# Altium project PROC154E3_SCH.PrjPcb (part 1 of 60)
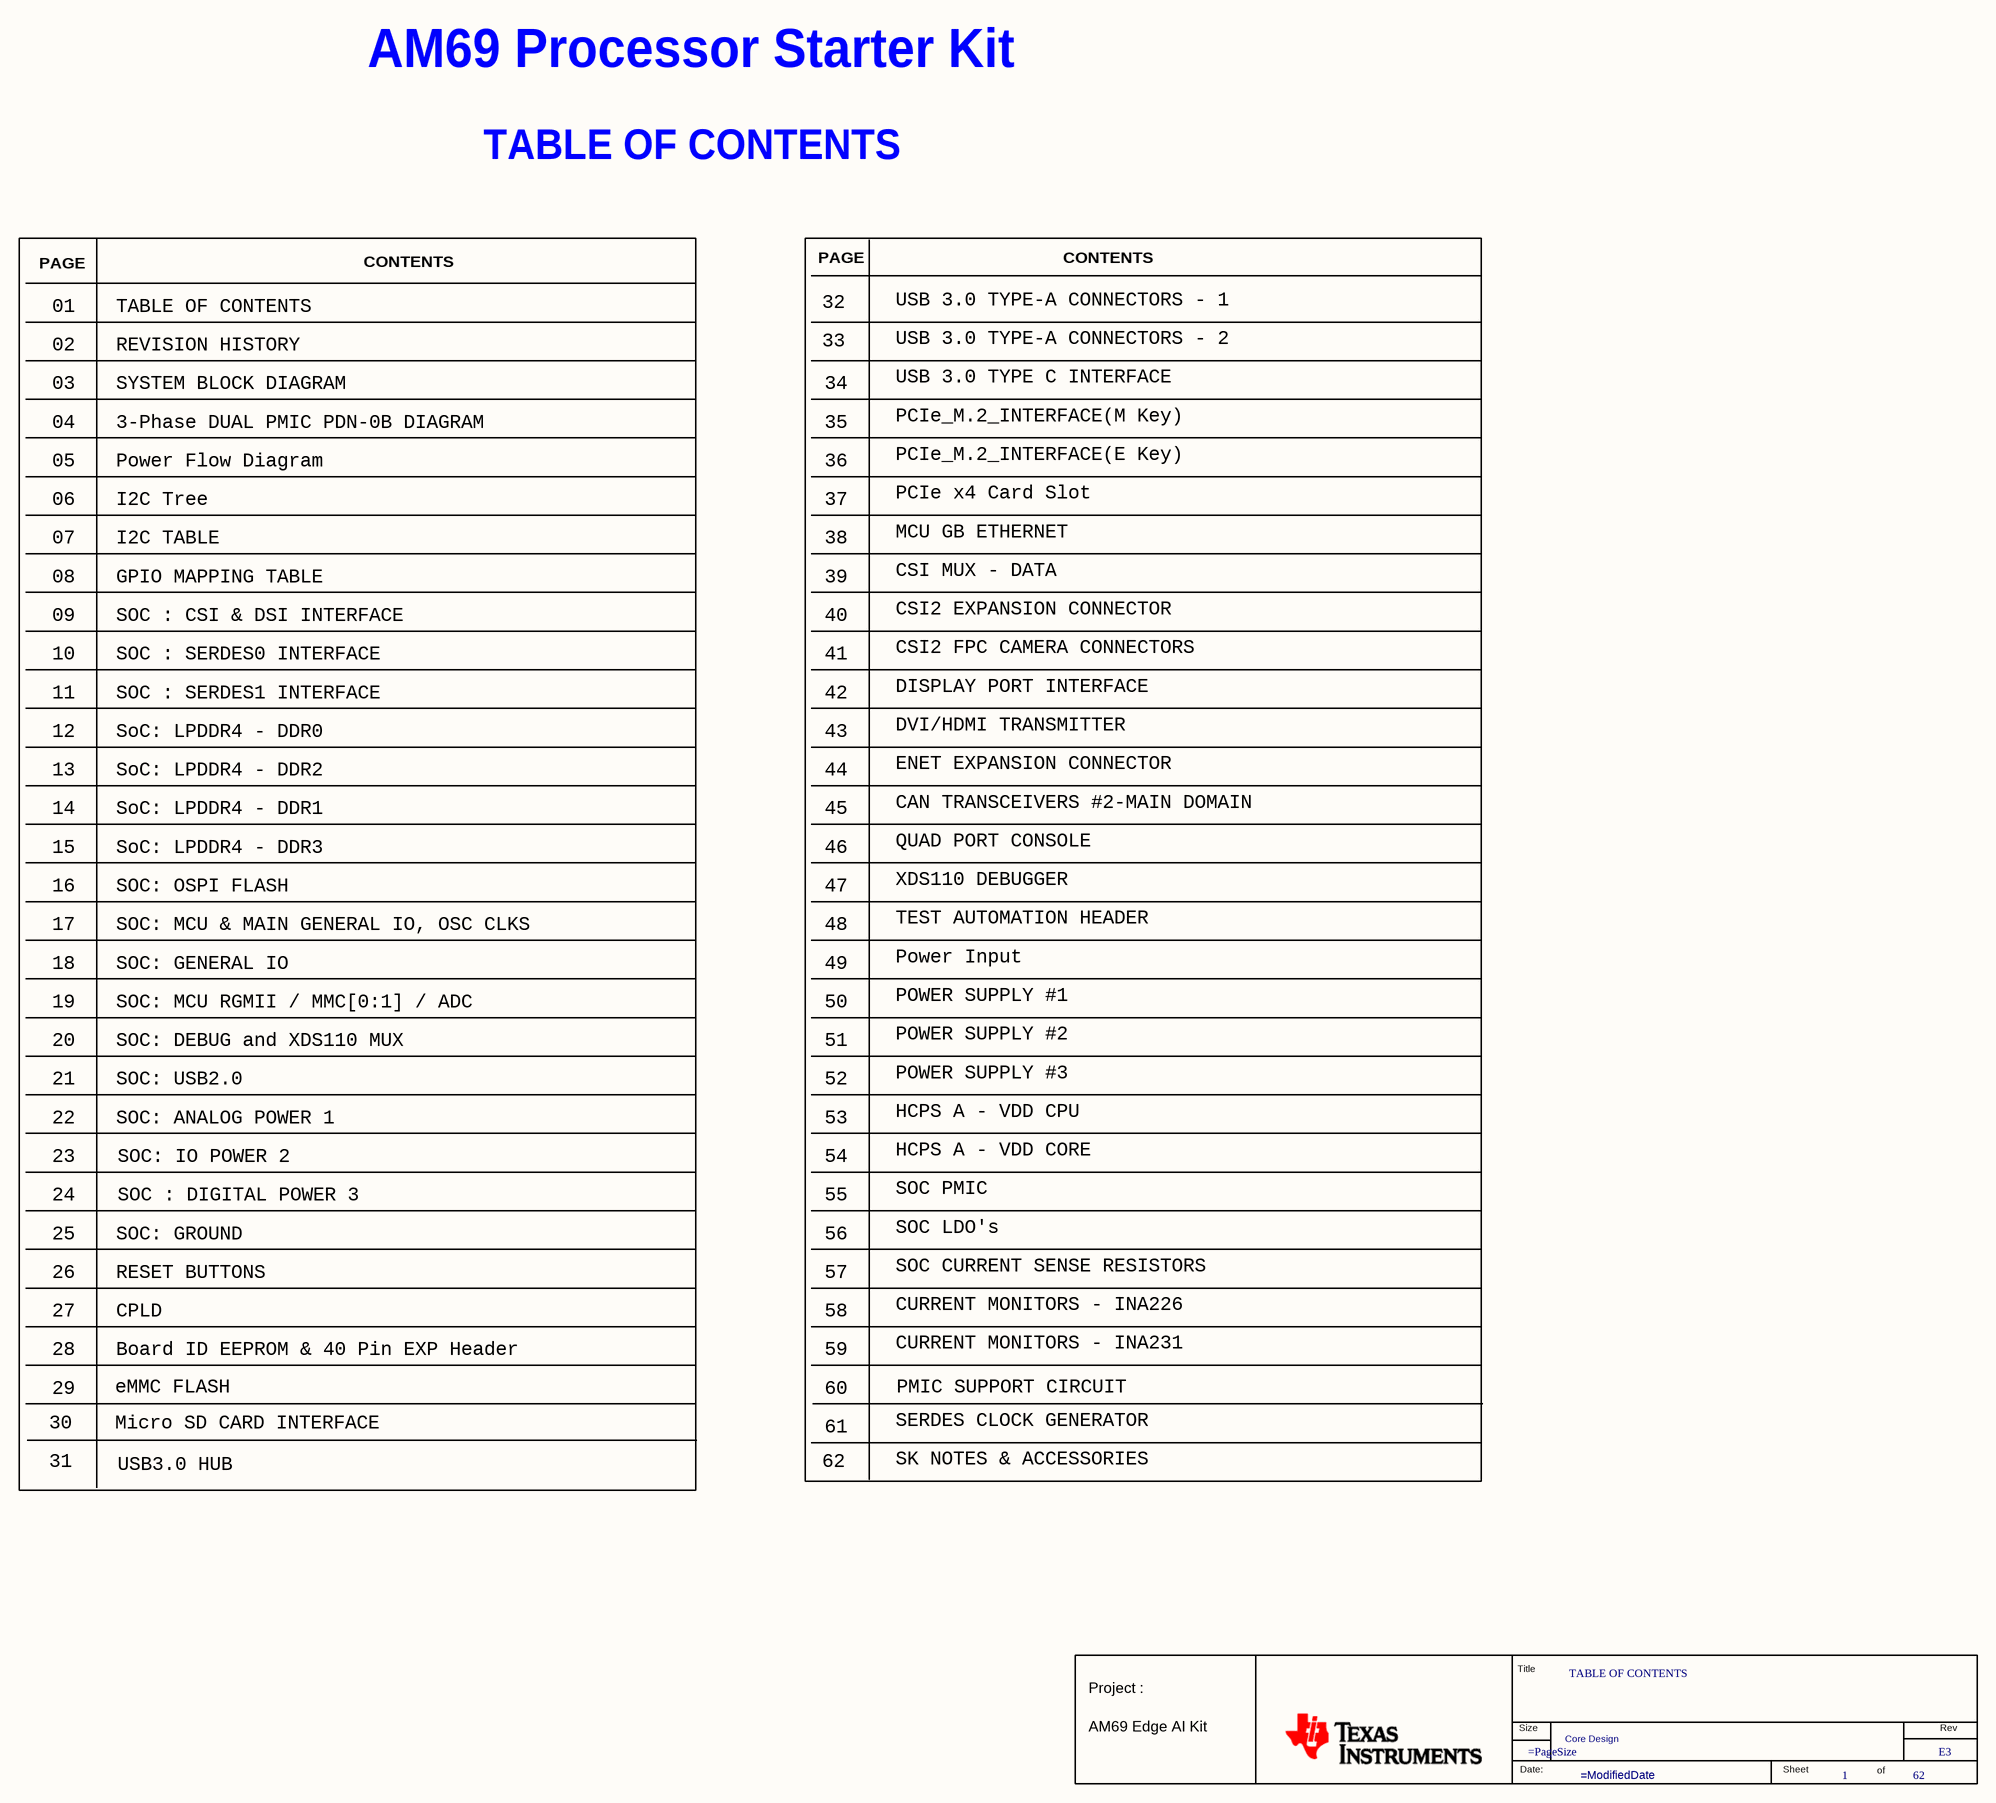
[diagram p0: 01. TABLE OF CONTENTS.SchDoc]
62 sheets, 2083 parts. Net scope: global (net labels, ports and power ports of the same name join across sheets).
Sheets:
  01. TABLE OF CONTENTS.SchDoc
  02. REVISION HISTORY.SchDoc
  03.  SYSTEM BLOCK DGM.SchDoc
  04.  SoC EVM PMIC PDN-0.6.SchDoc
  05.  POWER FLOW DIAGRAM.SchDoc
  06.  I2C TREE.SchDoc
  07.  I2C TABLE.SchDoc
  08. SOC GPIO_MAPPING_TABLE.SchDoc
  09. SOC CSI & DSI IF.SchDoc
  10. SOC SERDES0 IF.SchDoc
  11. SOC SERDES1 IF.SchDoc
  12. SOC EMIF0 & LPDDR4.SchDoc
  13. SOC EMIF1 & LPDDR4.SchDoc
  14. SOC EMIF2 & LPDDR4.SchDoc
  15. SOC EMIF3 & LPDDR4.SchDoc
  16. SOC MCU OSPI0 FLASH.SchDoc
  17. SOC MCU & MAIN GEN IO, OSC.SchDoc
  18. SOC GENERAL.SchDoc
  19. SOC MCU RGMII & MMC & ADCs.SchDoc
  20. SOC DEBUG.SchDoc
  21. SOC USB2.0.SchDoc
  22. SOC ANALOG POWER 1.SchDoc
  23. SOC IO & SUPPORT POWER 2.SchDoc
  24. SOC DIGITAL POWER 3.SchDoc
  25. SOC GND & KELVIN SENSING.SchDoc
  26. RESET BUTTONs.SchDoc
  27. CPLD.SchDoc
  28. BOARD ID & 40 Pin EXP Hdr.SchDoc
  29. eMMC.SchDoc
  30. MICRO SDCARD INTERFACE.SchDoc
  31. USB HUB.SchDoc
  32. USB 3.0 TYPE A CONN#1.SchDoc
  33. USB 3.0 TYPE A CONN#2.SchDoc
  34. USB TYPE C 3.0.SchDoc
  35. PCIe_M.2_INTERFACE SSD.SchDoc
  36. PCIe_M.2_INTERFACE SDIO.SchDoc
  37. PCIe_INTERFACE 4L.SchDoc
  38. MCU GB ETHERNET.SchDoc
  39. CSI MUX.SchDoc
  40. CSI2 CAMERA CONNECTOR.SchDoc
  41. FPC Camera.SchDoc
  42. DISPLAY PORT.SchDoc
  43. HDMI BRIDGE.SchDoc
  44. SGMII EXPANSION HDR.SchDoc
  45. CAN TRANSCEIVERS.SchDoc
  46. QUAD PORT CONSOLE.SchDoc
  47. XDS110 DEBUGGER.SchDoc
  48. TEST AUTOMATION HEADER.SchDoc
  49. POWER INPUT.SchDoc
  50. POWER SUPPLY #1.SchDoc
  51. POWER SUPPLY #2.SchDoc
  52. POWER SUPPLY #3.SchDoc
  53. SOC CPU HCPS-A.SchDoc
  54. SOC CORE HCPS-B.SchDoc
  55. SOC PMIC.SchDoc
  56. SOC LDOs & LD SWITCHES.SchDoc
  57. EVM SOC CURRENT_SENSE_RES.SchDoc
  58. CURRENT MONITORS.SchDoc
  59. CURRENT MONITORS -INA231.SchDoc
  60. SVS MONITOR.SchDoc
  61. SERDES CLOCK GENERATORS.SchDoc
  62. SK NOTES, HW & LABELS.SchDoc

## Sheet 01. TABLE OF CONTENTS.SchDoc: TABLE OF CONTENTS
size 513 x 386 mm; Page Create Date: March  8, 1995; Variant Name: Core Design; Page Number: 1; Schematic Page Number: 1; Page Size: C; Comment: MISTRAL_TITLEBLK_CSIZE_1; Page Count: 62; Project: PROC154E2(001)_SK_AM69; Issue: 1.0; RevCode: E3; DsnPath: C:\Users\danie\Downloads\sprr466c\PROC154E3_RP\PROC154E3_SCH.DSN; SchematicName: SCHEMATIC1; PageName: 01. TABLE OF CONTENTS; PageSize: C; TopSchematic: True

### Parts
(Parts that share a designator on the sheet are numbered #1, #2 ... from top to bottom, then left to right.)
*#1  RevCode: E3  Title: TABLE OF CONTENTS  Page Number: 1  Page Count: 62  Variant Name: Core Design  (hidden comment: MISTRAL_TITLEBLK_CSIZE_1)  (graphical)

### Notes on the sheet
- AM69 Processor Starter Kit
- TABLE OF CONTENTS
- PAGE
- CONTENTS
- 01
- 32
- USB 3.0 TYPE-A CONNECTORS - 1
- 02
- 03
- REVISION HISTORY
- SYSTEM BLOCK DIAGRAM
- 33
- 34
- USB 3.0 TYPE-A CONNECTORS - 2
- USB 3.0 TYPE C INTERFACE
- 04
- 05
- Power Flow Diagram
- 3-Phase DUAL PMIC PDN-0B DIAGRAM
- 35
- 36
- PCIe_M.2_INTERFACE(M Key)
- PCIe_M.2_INTERFACE(E Key)
- 06
- I2C Tree
- 37
- PCIe x4 Card Slot
- 07
- 08
- I2C TABLE
- GPIO MAPPING TABLE
- 38
- 39
- MCU GB ETHERNET
- CSI MUX - DATA
- 10
- 09
- SOC : CSI & DSI INTERFACE
- SOC : SERDES0 INTERFACE
- 40
- 41
- CSI2 EXPANSION CONNECTOR
- CSI2 FPC CAMERA CONNECTORS
- 11
- SOC : SERDES1 INTERFACE
- 42
- DISPLAY PORT INTERFACE
- 12
- 13
- SoC: LPDDR4 - DDR2
- SoC: LPDDR4 - DDR0
- 43
- 44
- DVI/HDMI TRANSMITTER
- ENET EXPANSION CONNECTOR
- 14
- 15
- SoC: LPDDR4 - DDR1
- SoC: LPDDR4 - DDR3
- 45
- 46
- CAN TRANSCEIVERS #2-MAIN DOMAIN
- QUAD PORT CONSOLE
- 16
- SOC: OSPI FLASH
- 47
- XDS110 DEBUGGER
- 17
- 18
- SOC: MCU & MAIN GENERAL IO, OSC CLKS
- SOC: GENERAL IO
- 48
- 49
- TEST AUTOMATION HEADER
- Power Input
- 19
- 20
- SOC: MCU RGMII / MMC[0:1] / ADC
- SOC: DEBUG and XDS110 MUX
- 50
- 51
- POWER SUPPLY #1
- POWER SUPPLY #2
- 21
- SOC: USB2.0
- 52
- POWER SUPPLY #3
- 22
- 23
- SOC: ANALOG POWER 1
- SOC: IO POWER 2
- 53
- 54
- HCPS A - VDD CPU
- HCPS A - VDD CORE
- 24
- 25
- SOC: GROUND
- SOC : DIGITAL POWER 3
- 55
- 56
- SOC PMIC
- SOC LDO's
- 26
- RESET BUTTONS
- 57
- SOC CURRENT SENSE RESISTORS
- 27
- 28
- CPLD
- Board ID EEPROM & 40 Pin EXP Header
- 58
- 59
- CURRENT MONITORS - INA226
- CURRENT MONITORS - INA231
- 30
- 29
- Micro SD CARD INTERFACE
- eMMC FLASH
- 60
- 61
- SERDES CLOCK GENERATOR
- PMIC SUPPORT CIRCUIT
- 31
- USB3.0 HUB
- 62
- SK NOTES & ACCESSORIES
- (in symbol MISTRAL_TITLEBLK_CSIZE_1) Title; Project :; Size; Rev; AM69 Edge AI Kit; Date:; Sheet; of

### Library data of the parts
*#1 = MISTRAL_TITLEBLK_CSIZE_1: Issue: 1.0; Project: PROC154E2(001)_SK_AM69; Page Create Date: March  8, 1995; Page Size: =PageSize; Page Modify Date: =ModifiedDate; Schematic Page Number: 1

## Sheet 02. REVISION HISTORY.SchDoc: REVISION HISTORY
size 513 x 386 mm; Project: PROC154E2(001)_SK_AM69; Issue: 1.0; RevCode: E3; Page Create Date: March  8, 1995; Variant Name: Core Design; Schematic Page Number: 2; Page Number: 2; Page Size: C; Comment: MISTRAL_TITLEBLK_CSIZE_1; Page Count: 62; Schematic Page Count: 62; Name: PROC154E2 001 SK AM69; DsnPath: C:\Users\danie\Downloads\sprr466c\PROC154E3_RP\PROC154E3_SCH.DSN; SchematicName: SCHEMATIC1; PageName: 02. REVISION HISTORY; PageSize: C; TopSchematic: True
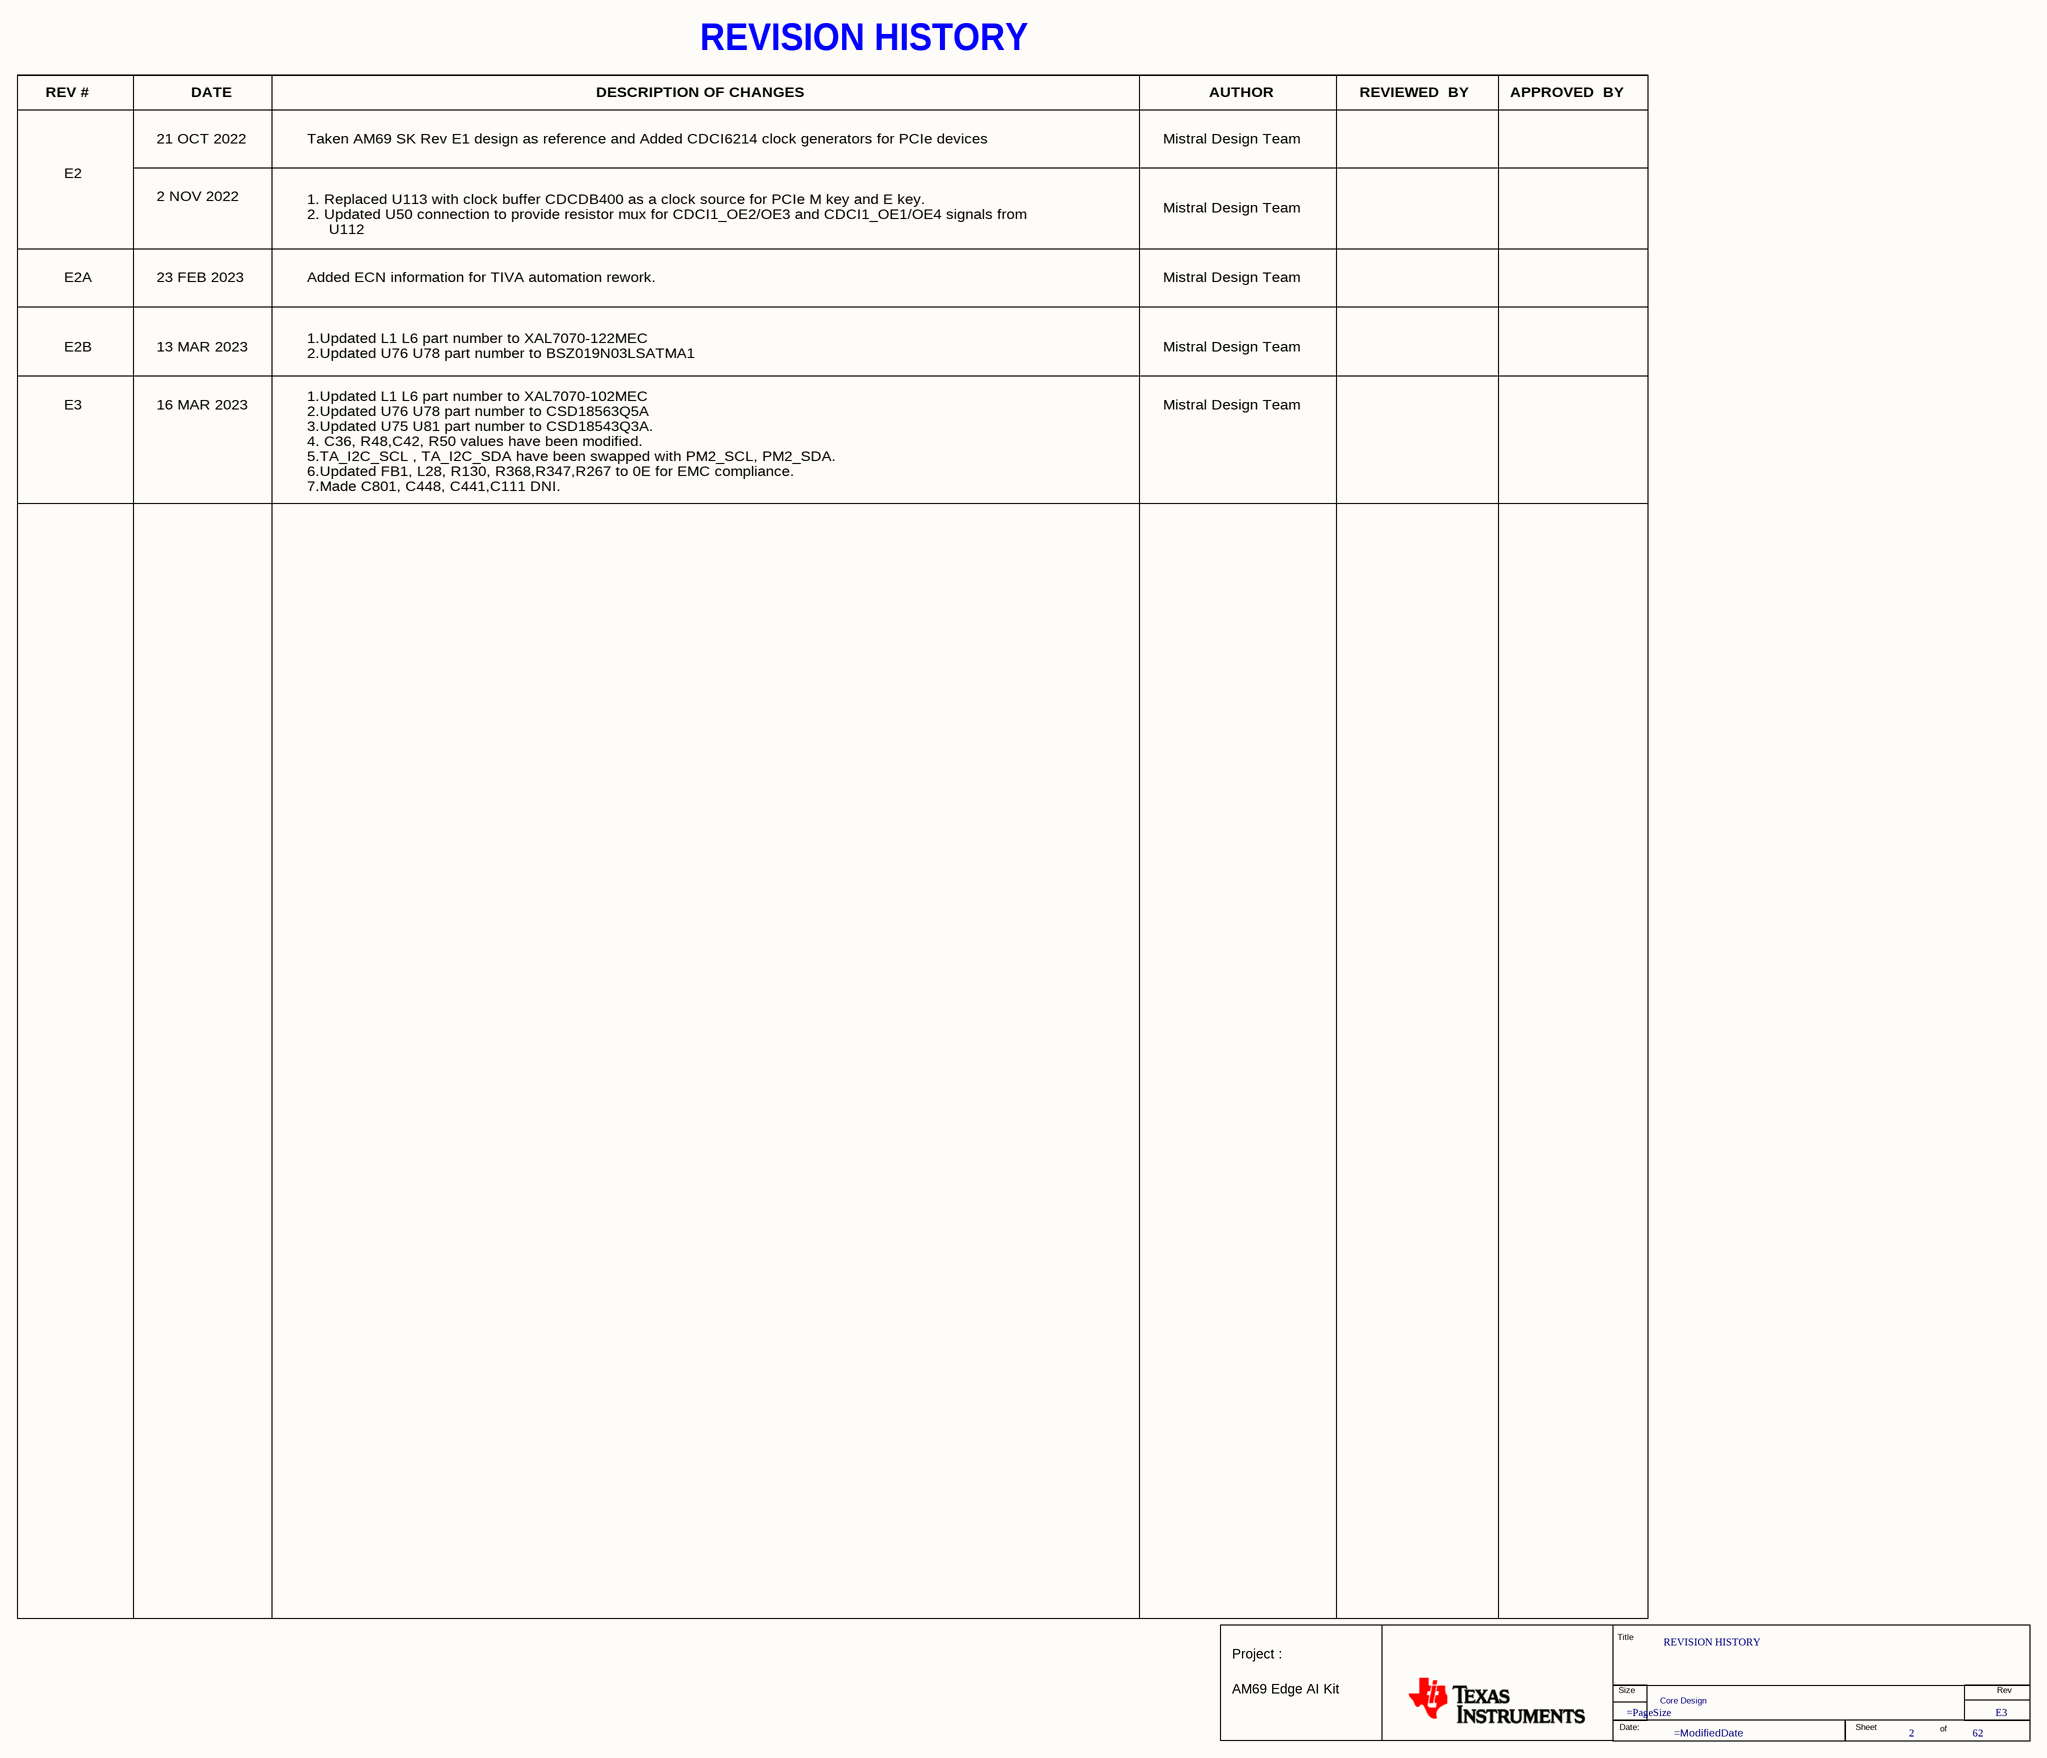
[diagram p1: 02. REVISION HISTORY.SchDoc]

### Parts
(Parts that share a designator on the sheet are numbered #1, #2 ... from top to bottom, then left to right.)
*#2  RevCode: E3  Title: REVISION HISTORY  Page Number: 2  Page Count: 62  Variant Name: Core Design  (hidden comment: MISTRAL_TITLEBLK_CSIZE_1)  (graphical)

### Notes on the sheet
- REV #
- DATE
- DESCRIPTION OF CHANGES
- REVISION HISTORY
- AUTHOR
- REVIEWED  BY
- APPROVED  BY
- 21 OCT 2022
- Taken AM69 SK Rev E1 design as reference and Added CDCI6214 clock generators for PCIe devices
- Mistral Design Team
- E2
- 2 NOV 2022
- 1. Replaced U113 with clock buffer CDCDB400 as a clock source for PCIe M key and E key.
  2. Updated U50 connection to provide resistor mux for CDCI1_OE2/OE3 and CDCI1_OE1/OE4 signals from
  U112
- E2A
- 23 FEB 2023
- Added ECN information for TIVA automation rework.
- 1.Updated L1 L6 part number to XAL7070-122MEC
  2.Updated U76 U78 part number to BSZ019N03LSATMA1
- E2B
- 13 MAR 2023
- 1.Updated L1 L6 part number to XAL7070-102MEC
  2.Updated U76 U78 part number to CSD18563Q5A
  3.Updated U75 U81 part number to CSD18543Q3A.
  4. C36, R48,C42, R50 values have been modified.
  5.TA_I2C_SCL , TA_I2C_SDA have been swapped with PM2_SCL, PM2_SDA.
  6.Updated FB1, L28, R130, R368,R347,R267 to 0E for EMC compliance.
  7.Made C801, C448, C441,C111 DNI.
- E3
- 16 MAR 2023
- (in symbol MISTRAL_TITLEBLK_CSIZE_1) Title; Project :; Size; Rev; AM69 Edge AI Kit; Date:; Sheet; of

### Library data of the parts
*#2 = MISTRAL_TITLEBLK_CSIZE_1: Issue: 1.0; Project: PROC154E2(001)_SK_AM69; Name: PROC154E2 001 SK AM69; Page Create Date: March  8, 1995; Page Size: =PageSize; Page Modify Date: =ModifiedDate; Schematic Page Count: 62; Schematic Page Number: 2

## Sheet 03.  SYSTEM BLOCK DGM.SchDoc: SYSTEM BLOCK DIAGRAM
size 513 x 386 mm; Project: PROC154E2(001)_SK_AM69; Issue: 1.0; RevCode: E3; Page Create Date: March  8, 1995; Variant Name: Core Design; Schematic Page Number: 3; Page Number: 3; Page Size: C; Comment: MISTRAL_TITLEBLK_CSIZE_1; Page Count: 62; Schematic Page Count: 62; Name: PROC154E2 001 SK AM69; DsnPath: C:\Users\danie\Downloads\sprr466c\PROC154E3_RP\PROC154E3_SCH.DSN; SchematicName: SCHEMATIC1; PageName: 03.  SYSTEM BLOCK DGM; PageSize: C; TopSchematic: True
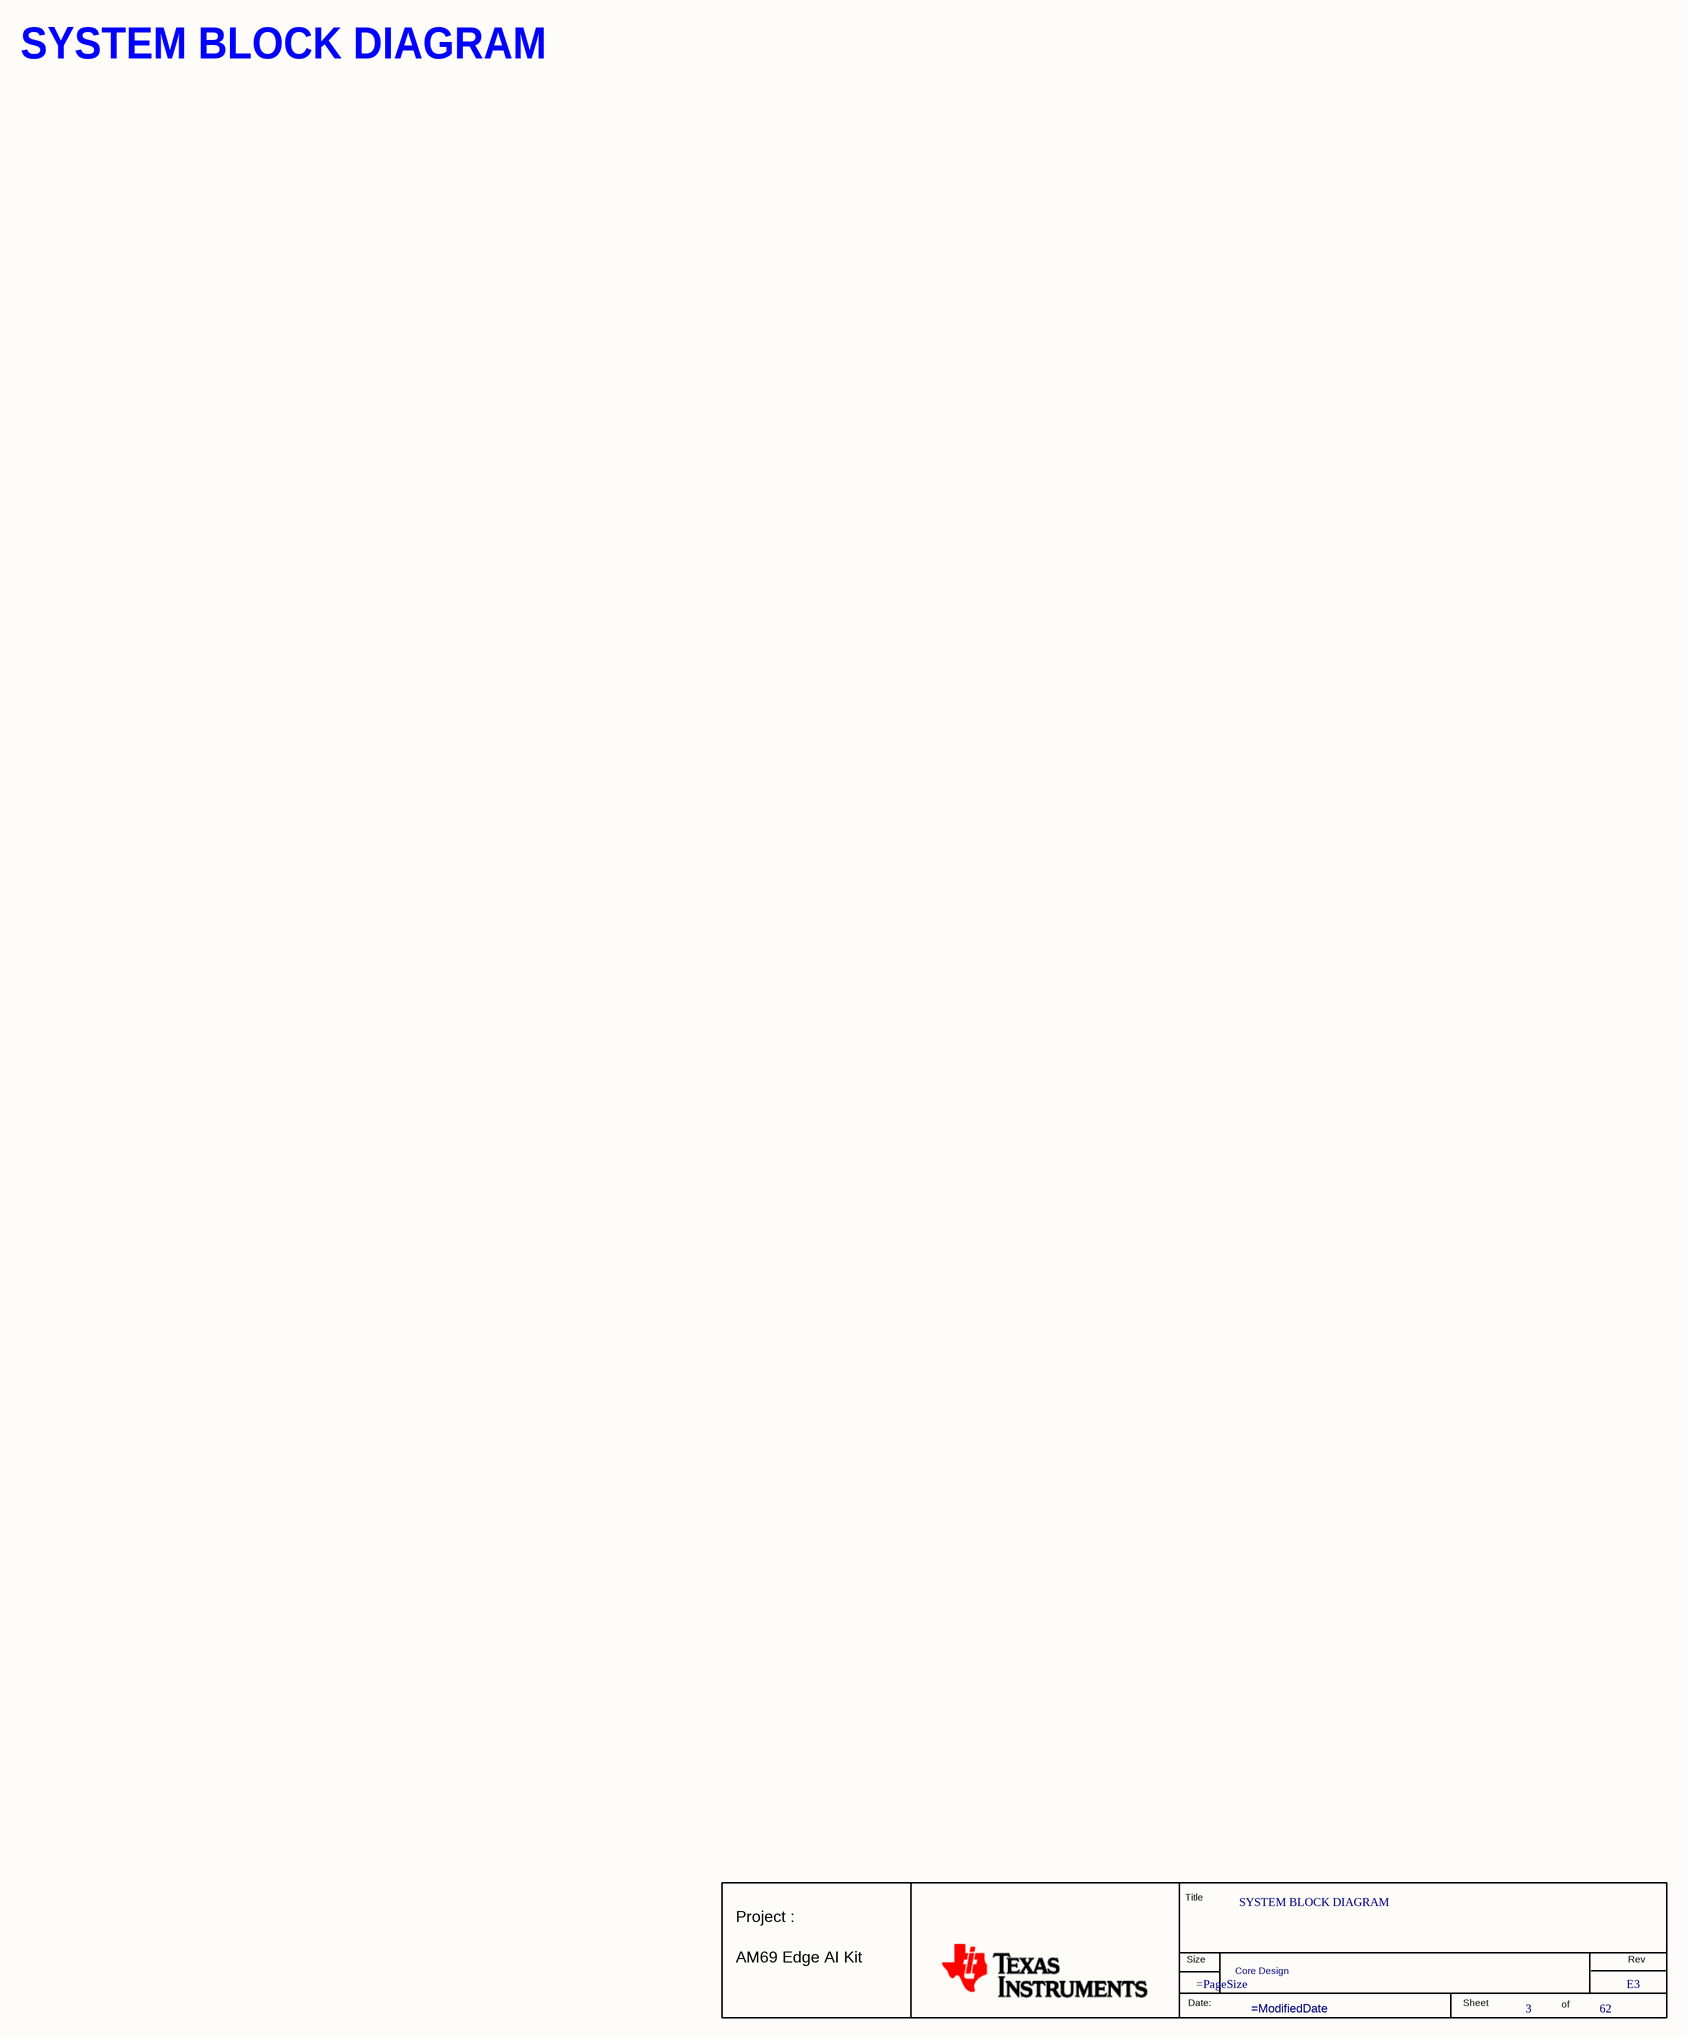
[diagram p2: 03.  SYSTEM BLOCK DGM.SchDoc]

### Parts
(Parts that share a designator on the sheet are numbered #1, #2 ... from top to bottom, then left to right.)
*#3  RevCode: E3  Title: SYSTEM BLOCK DIAGRAM  Page Number: 3  Page Count: 62  Variant Name: Core Design  (hidden comment: MISTRAL_TITLEBLK_CSIZE_1)  (graphical)

### Notes on the sheet
- SYSTEM BLOCK DIAGRAM
- (in symbol MISTRAL_TITLEBLK_CSIZE_1) Title; Project :; Size; Rev; AM69 Edge AI Kit; Date:; Sheet; of

### Library data of the parts
*#3 = MISTRAL_TITLEBLK_CSIZE_1: as *#2 on sheet 02. REVISION HISTORY; Page Create Date: March  8, 1995; Page Size: =PageSize; Page Modify Date: =ModifiedDate; Schematic Page Count: 62; Schematic Page Number: 3

## Sheet 04.  SoC EVM PMIC PDN-0.6.SchDoc: SoC EVM PMIC PDN-0.6
size 513 x 386 mm; Project: PROC154E2(001)_SK_AM69; Issue: 1.0; RevCode: E3; Page Create Date: March  8, 1995; Variant Name: Core Design; Schematic Page Number: 4; Page Number: 4; Page Size: C; Comment: MISTRAL_TITLEBLK_CSIZE_1; Page Count: 62; Schematic Page Count: 62; Name: PROC154E2 001 SK AM69; DsnPath: C:\Users\danie\Downloads\sprr466c\PROC154E3_RP\PROC154E3_SCH.DSN; SchematicName: SCHEMATIC1; PageName: 04.  SoC EVM PMIC PDN-0.6; PageSize: C; TopSchematic: True
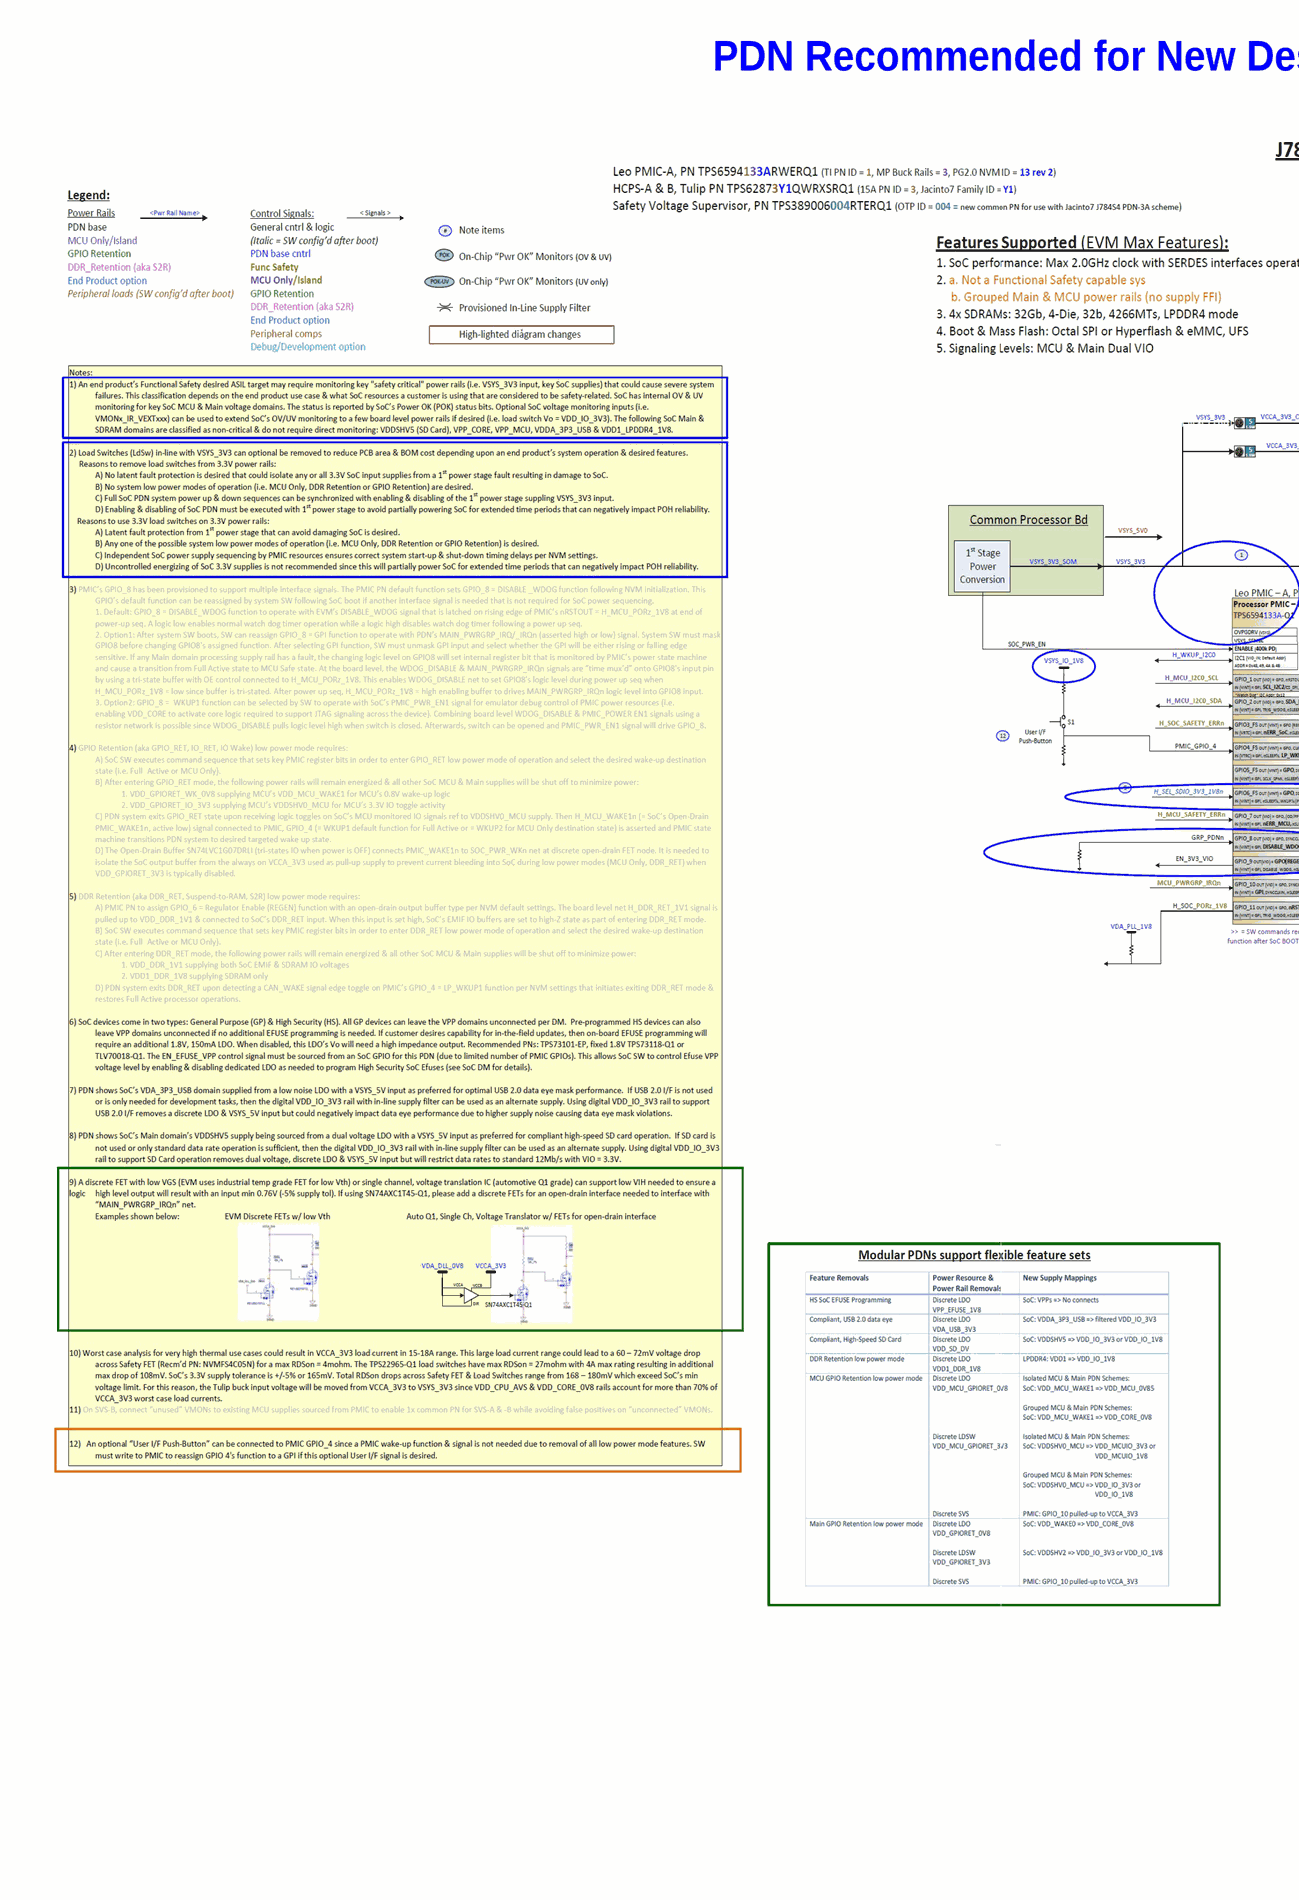
[diagram p3: 04.  SoC EVM PMIC PDN-0.6.SchDoc, left]
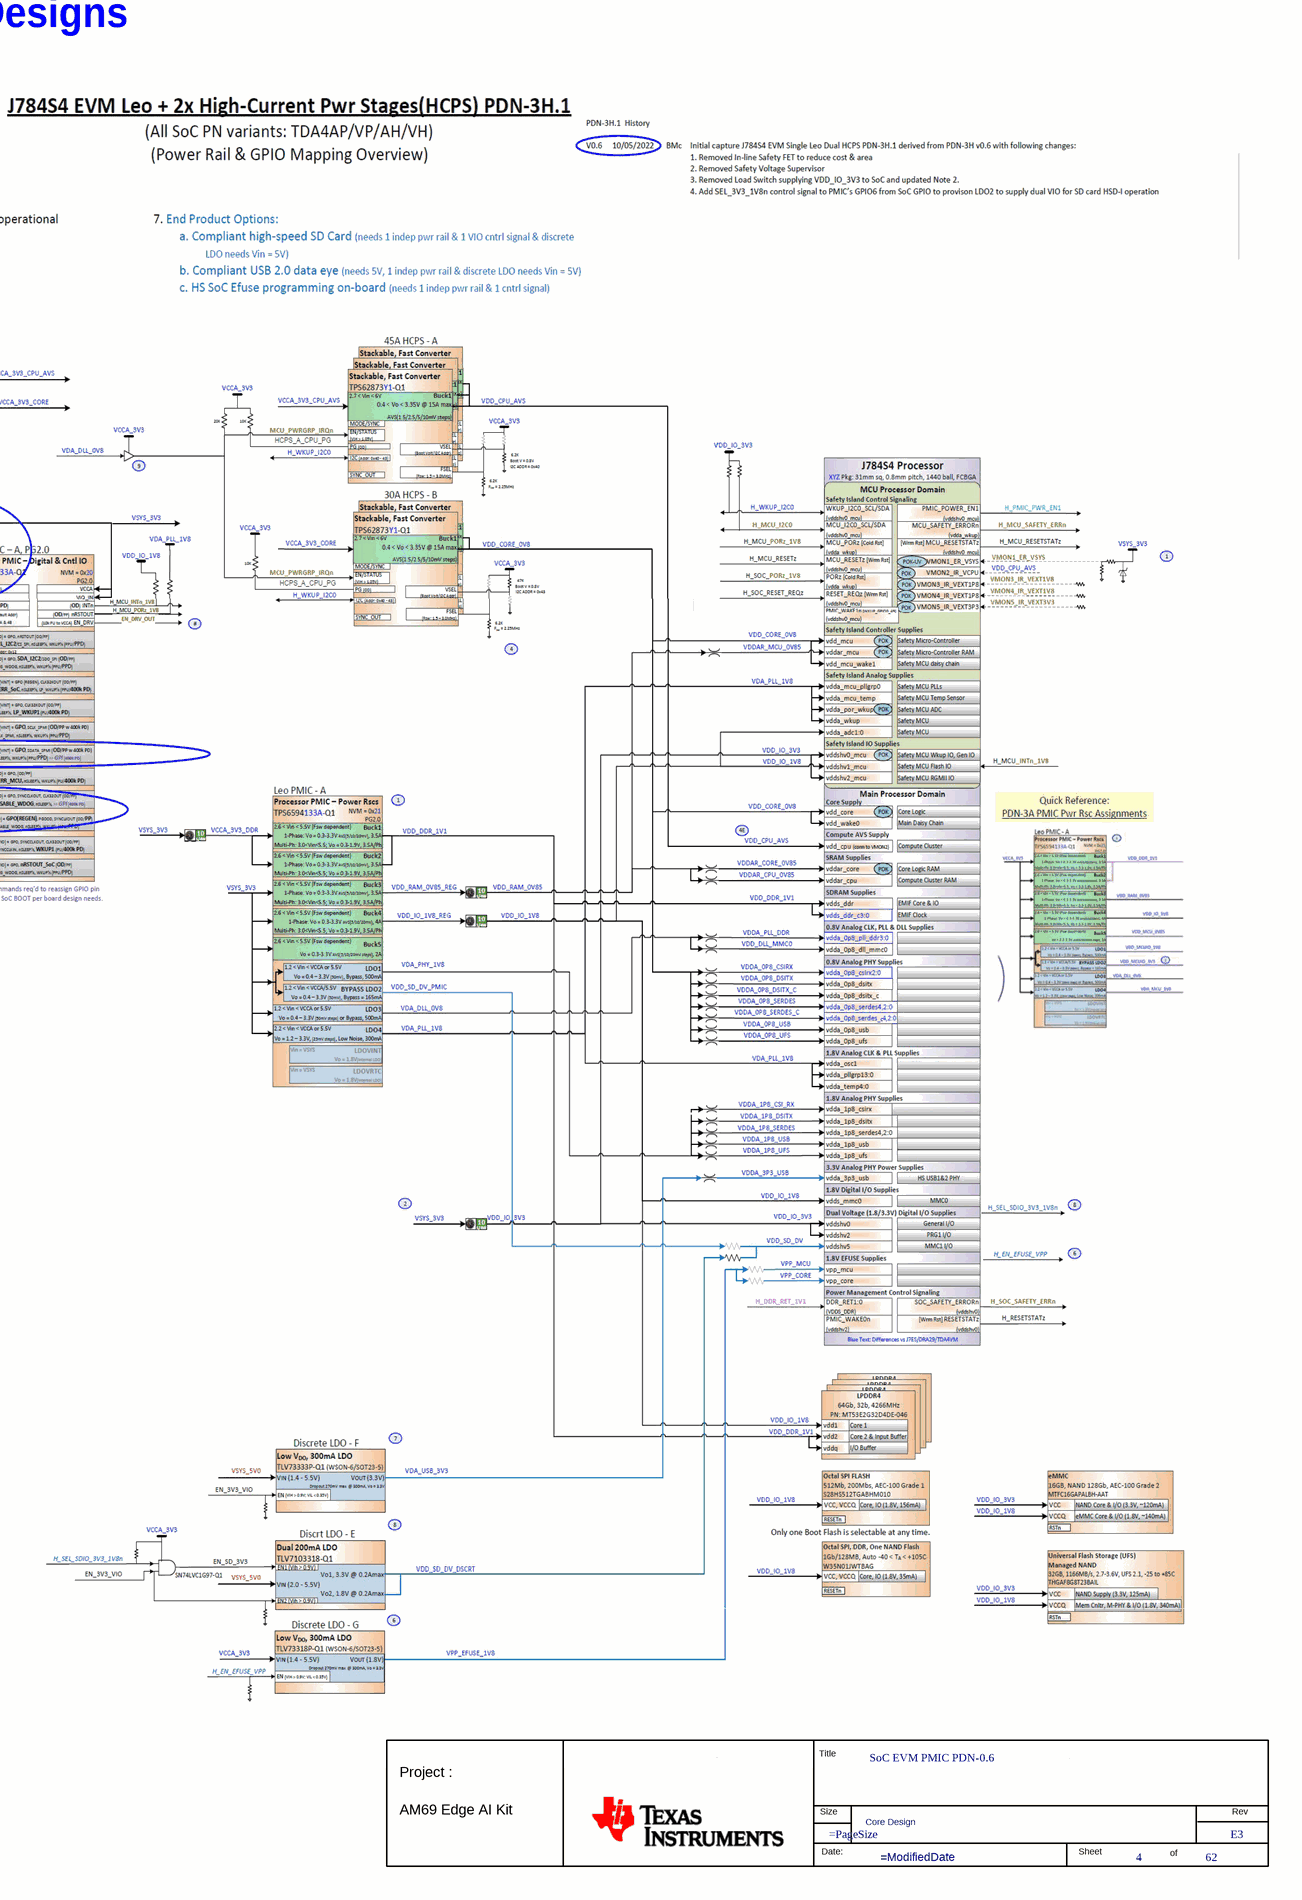
[diagram p4: 04.  SoC EVM PMIC PDN-0.6.SchDoc, right]

### Parts
(Parts that share a designator on the sheet are numbered #1, #2 ... from top to bottom, then left to right.)
*#4  RevCode: E3  Title: SoC EVM PMIC PDN-0.6  Page Number: 4  Page Count: 62  Variant Name: Core Design  (hidden comment: MISTRAL_TITLEBLK_CSIZE_1)  (graphical)

### Notes on the sheet
- PDN Recommended for New Designs
- (in symbol MISTRAL_TITLEBLK_CSIZE_1) Title; Project :; Size; Rev; AM69 Edge AI Kit; Date:; Sheet; of

### Library data of the parts
*#4 = MISTRAL_TITLEBLK_CSIZE_1: as *#2 on sheet 02. REVISION HISTORY; Page Create Date: March  8, 1995; Page Size: =PageSize; Page Modify Date: =ModifiedDate; Schematic Page Count: 62; Schematic Page Number: 4

## Sheet 05.  POWER FLOW DIAGRAM.SchDoc: POWER FLOW DIAGRAM
size 513 x 386 mm; Project: PROC154E2(001)_SK_AM69; Issue: 1.0; RevCode: E3; Page Create Date: March  8, 1995; Variant Name: Core Design; Schematic Page Number: 5; Page Number: 5; Page Size: C; Comment: MISTRAL_TITLEBLK_CSIZE_1; Page Count: 62; Schematic Page Count: 62; Name: PROC154E2 001 SK AM69; DsnPath: C:\Users\danie\Downloads\sprr466c\PROC154E3_RP\PROC154E3_SCH.DSN; SchematicName: SCHEMATIC1; PageName: 05.  POWER FLOW DIAGRAM; PageSize: C; TopSchematic: True
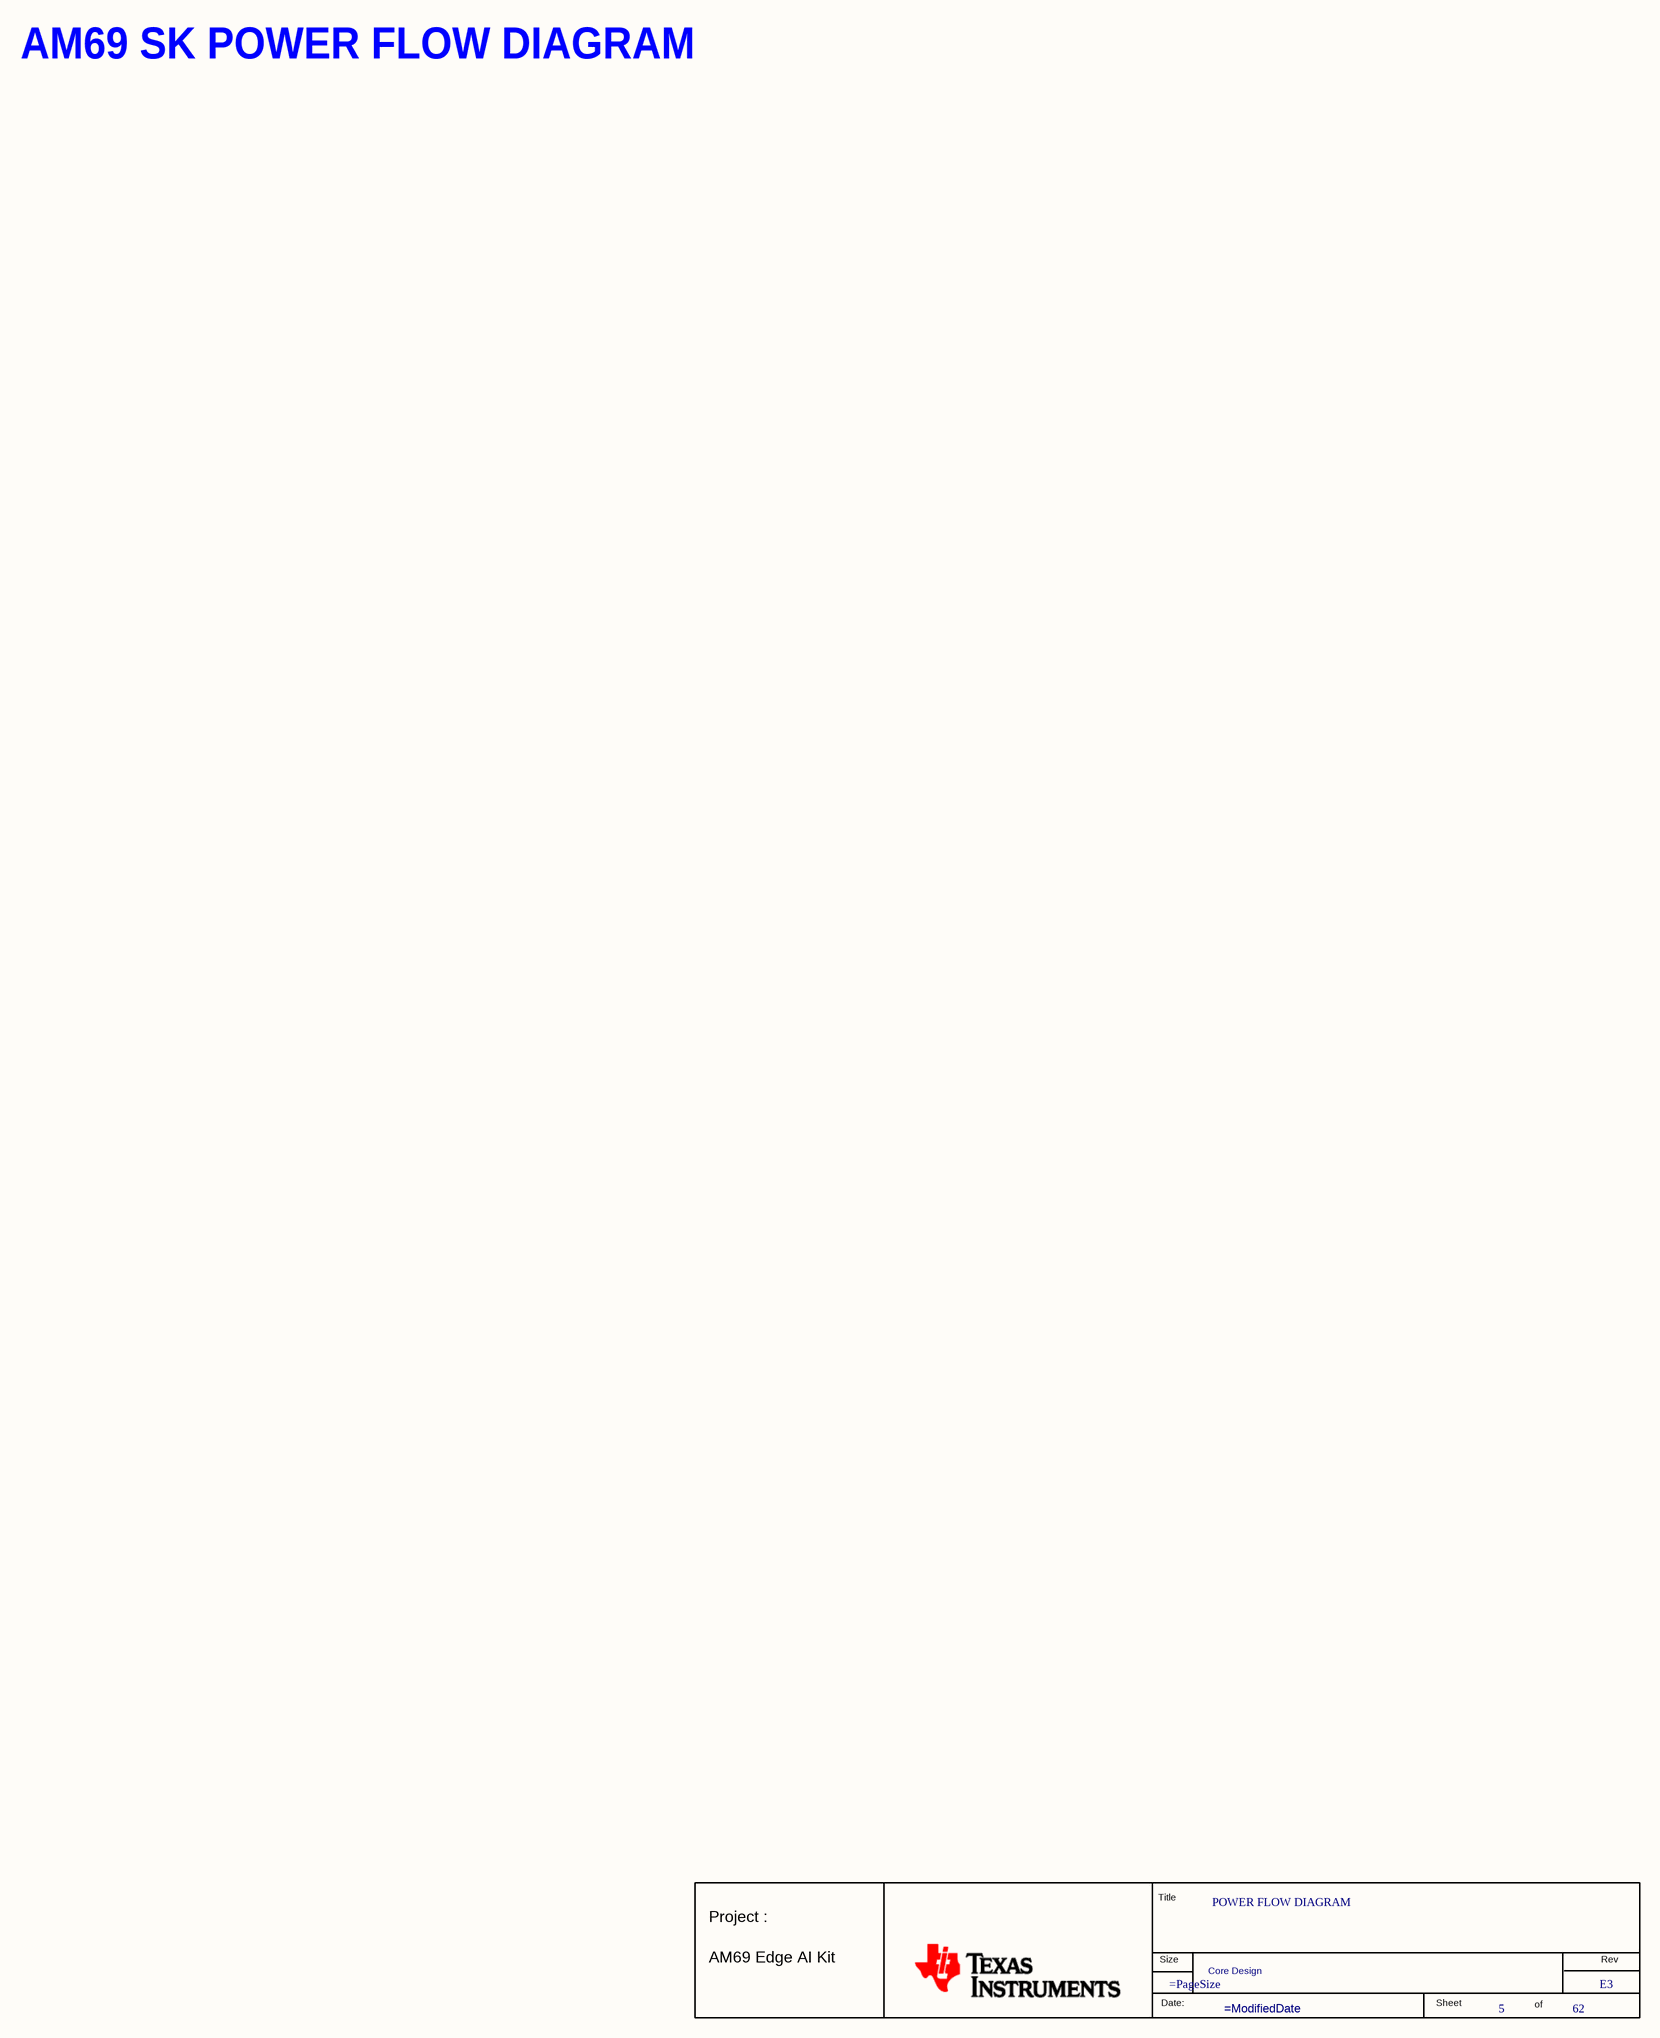
[diagram p5: 05.  POWER FLOW DIAGRAM.SchDoc]

### Parts
(Parts that share a designator on the sheet are numbered #1, #2 ... from top to bottom, then left to right.)
*#5  RevCode: E3  Title: POWER FLOW DIAGRAM  Page Number: 5  Page Count: 62  Variant Name: Core Design  (hidden comment: MISTRAL_TITLEBLK_CSIZE_1)  (graphical)

### Notes on the sheet
- AM69 SK POWER FLOW DIAGRAM
- (in symbol MISTRAL_TITLEBLK_CSIZE_1) Title; Project :; Size; Rev; AM69 Edge AI Kit; Date:; Sheet; of

### Library data of the parts
*#5 = MISTRAL_TITLEBLK_CSIZE_1: as *#2 on sheet 02. REVISION HISTORY; Page Create Date: March  8, 1995; Page Size: =PageSize; Page Modify Date: =ModifiedDate; Schematic Page Count: 62; Schematic Page Number: 5

## Sheet 06.  I2C TREE.SchDoc: I2C TREE
size 513 x 386 mm; Project: PROC154E2(001)_SK_AM69; Issue: 1.0; RevCode: E3; Page Create Date: March  8, 1995; Variant Name: Core Design; Schematic Page Number: 6; Page Number: 6; Page Size: C; Comment: MISTRAL_TITLEBLK_CSIZE_1; Page Count: 62; Schematic Page Count: 62; Name: PROC154E2 001 SK AM69; DsnPath: C:\Users\danie\Downloads\sprr466c\PROC154E3_RP\PROC154E3_SCH.DSN; SchematicName: SCHEMATIC1; PageName: 06.  I2C TREE; PageSize: C; TopSchematic: True
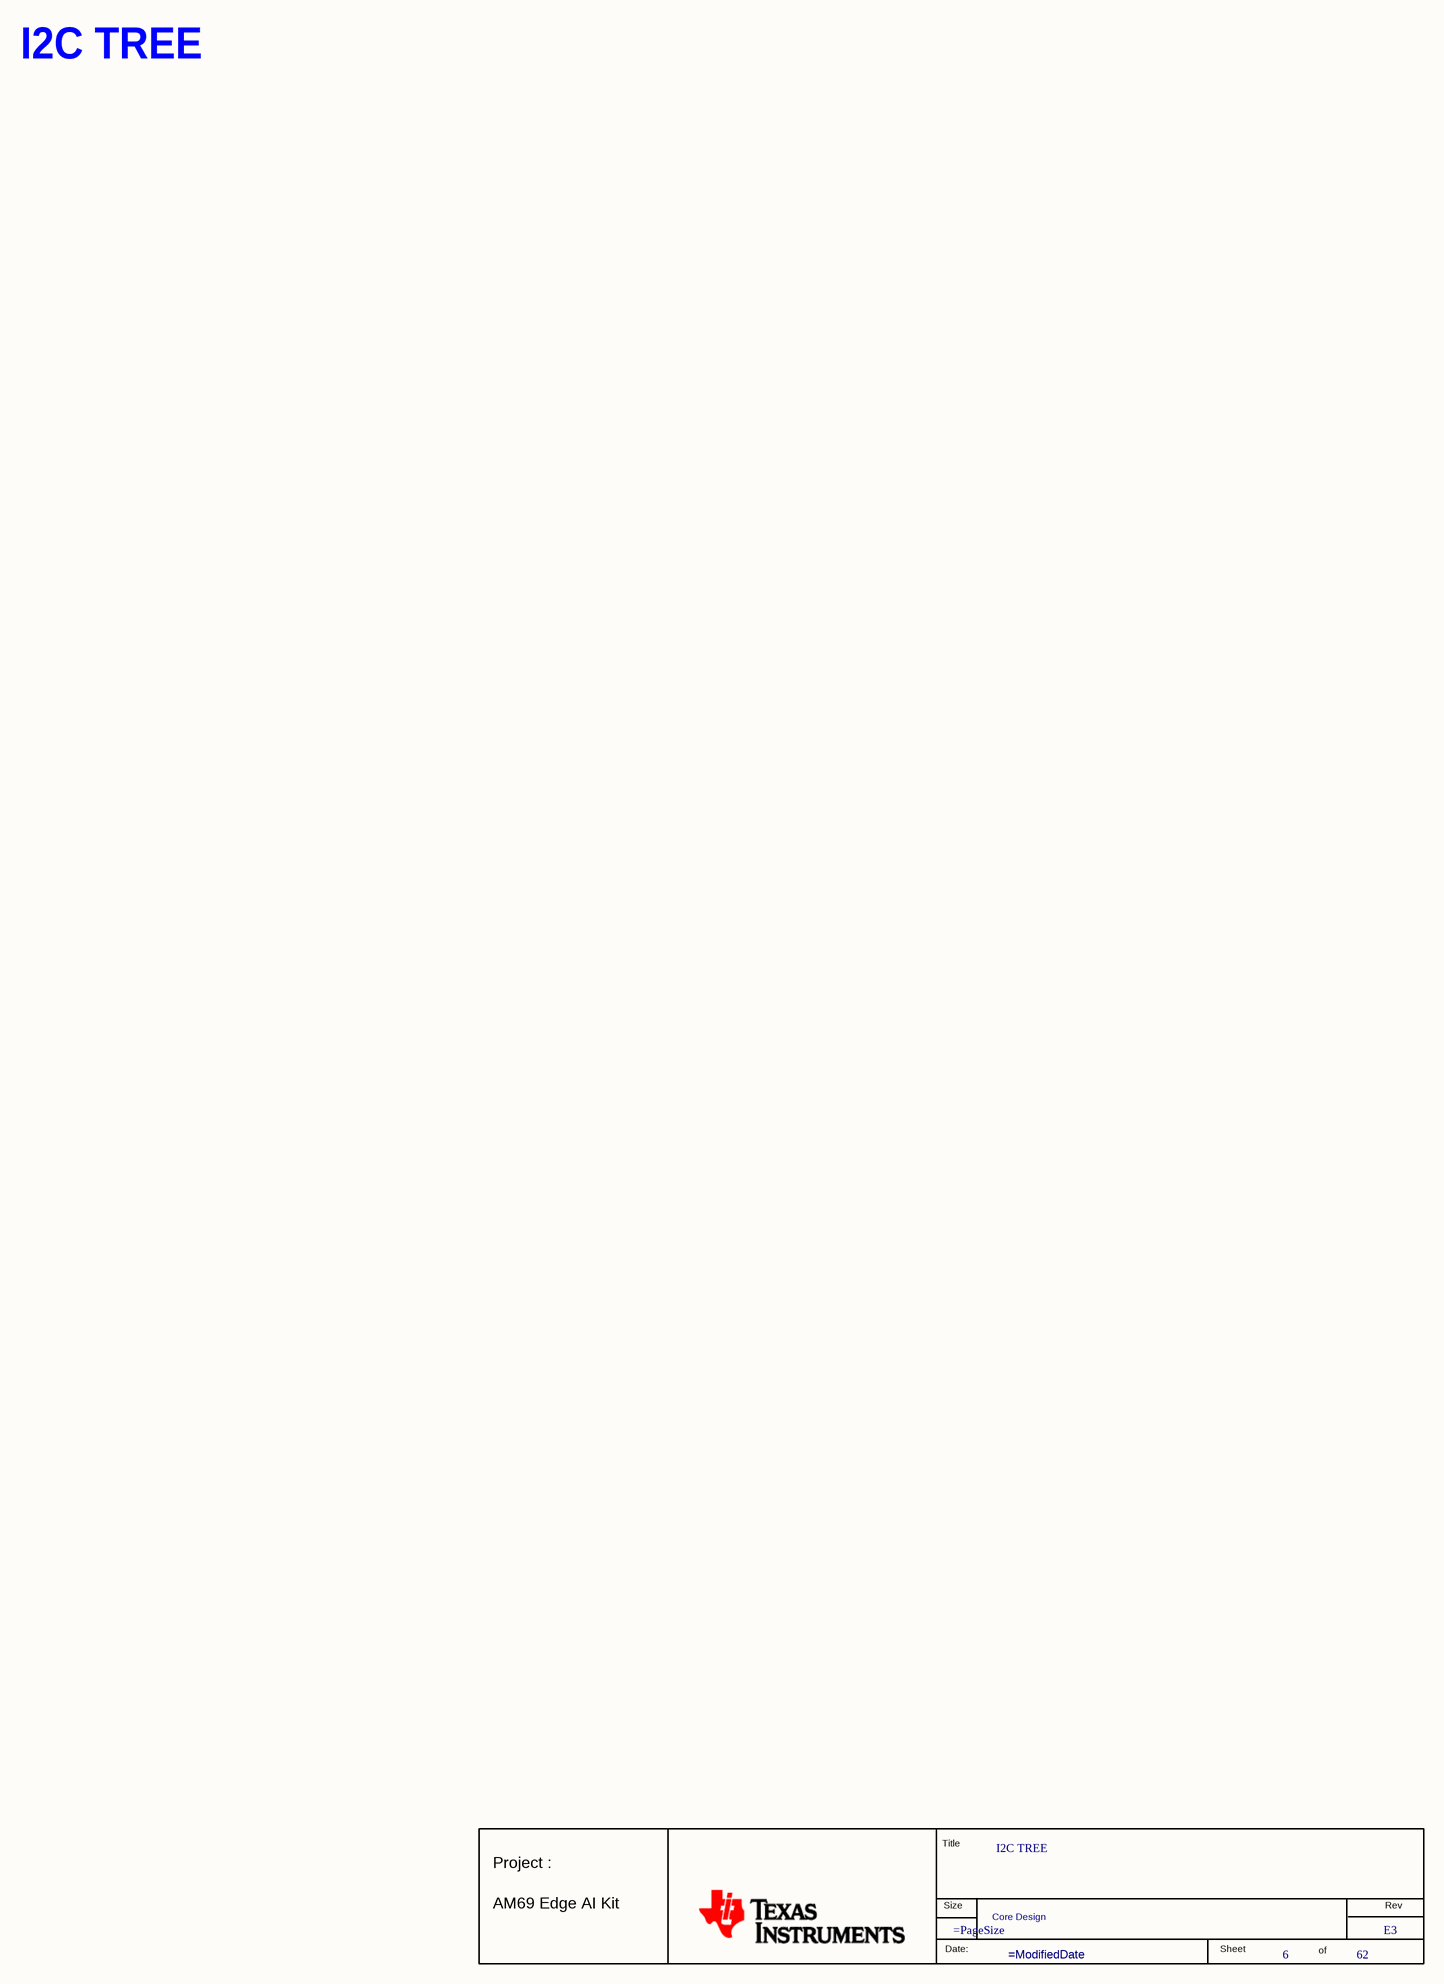
[diagram p6: 06.  I2C TREE.SchDoc]

### Parts
(Parts that share a designator on the sheet are numbered #1, #2 ... from top to bottom, then left to right.)
*#6  RevCode: E3  Title: I2C TREE  Page Number: 6  Page Count: 62  Variant Name: Core Design  (hidden comment: MISTRAL_TITLEBLK_CSIZE_1)  (graphical)

### Notes on the sheet
- I2C TREE
- (in symbol MISTRAL_TITLEBLK_CSIZE_1) Title; Project :; Size; Rev; AM69 Edge AI Kit; Date:; Sheet; of

### Library data of the parts
*#6 = MISTRAL_TITLEBLK_CSIZE_1: as *#2 on sheet 02. REVISION HISTORY; Page Create Date: March  8, 1995; Page Size: =PageSize; Page Modify Date: =ModifiedDate; Schematic Page Count: 62; Schematic Page Number: 6

## Sheet 07.  I2C TABLE.SchDoc: I2C TABLE
size 513 x 386 mm; Project: PROC154E2(001)_SK_AM69; Issue: 1.0; RevCode: E3; Page Create Date: March  8, 1995; Variant Name: Core Design; Schematic Page Number: 7; Page Number: 7; Page Size: C; Comment: MISTRAL_TITLEBLK_CSIZE_1; Page Count: 62; Schematic Page Count: 62; Name: PROC154E2 001 SK AM69; DsnPath: C:\Users\danie\Downloads\sprr466c\PROC154E3_RP\PROC154E3_SCH.DSN; SchematicName: SCHEMATIC1; PageName: 07.  I2C TABLE; PageSize: C; TopSchematic: True
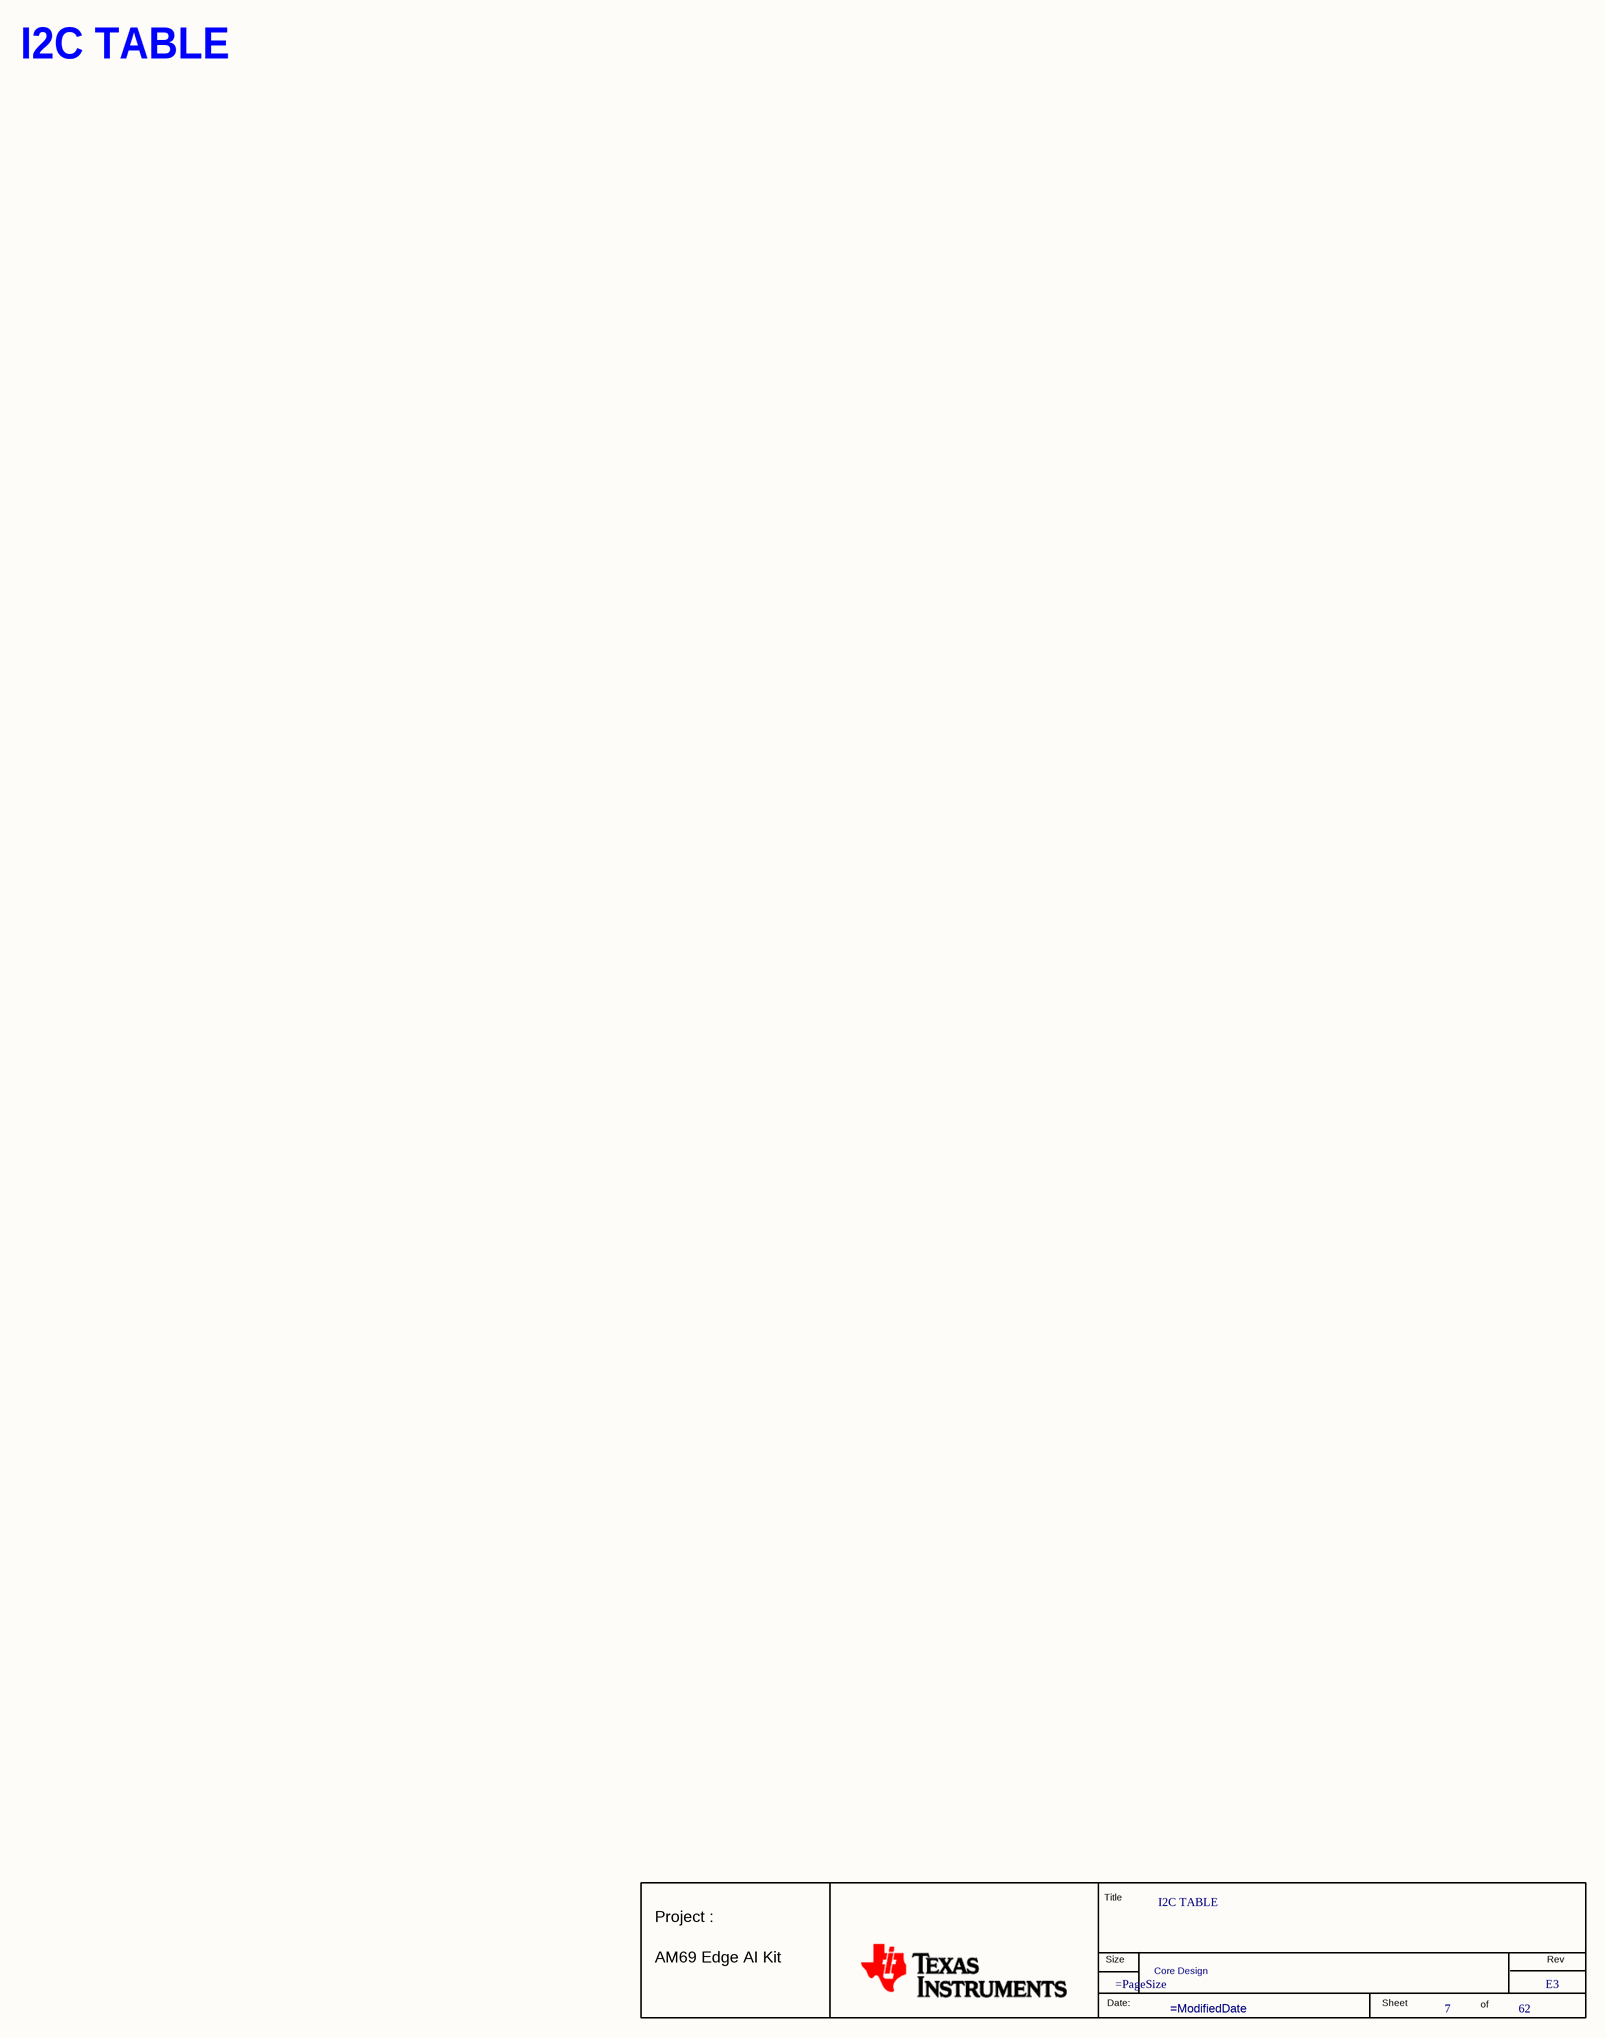
[diagram p7: 07.  I2C TABLE.SchDoc]

### Parts
(Parts that share a designator on the sheet are numbered #1, #2 ... from top to bottom, then left to right.)
*#7  RevCode: E3  Title: I2C TABLE  Page Number: 7  Page Count: 62  Variant Name: Core Design  (hidden comment: MISTRAL_TITLEBLK_CSIZE_1)  (graphical)

### Notes on the sheet
- I2C TABLE
- (in symbol MISTRAL_TITLEBLK_CSIZE_1) Title; Project :; Size; Rev; AM69 Edge AI Kit; Date:; Sheet; of

### Library data of the parts
*#7 = MISTRAL_TITLEBLK_CSIZE_1: as *#2 on sheet 02. REVISION HISTORY; Page Create Date: March  8, 1995; Page Size: =PageSize; Page Modify Date: =ModifiedDate; Schematic Page Count: 62; Schematic Page Number: 7

## Sheet 08. SOC GPIO_MAPPING_TABLE.SchDoc: SOC GPIO_MAPPING_TABLE
size 513 x 386 mm; Project: PROC154E2(001)_SK_AM69; Issue: 1.0; RevCode: E3; Page Create Date: March  8, 1995; Variant Name: Core Design; Schematic Page Number: 8; Page Number: 8; Page Size: C; Comment: MISTRAL_TITLEBLK_CSIZE_1; Page Count: 62; Schematic Page Count: 62; Name: PROC154E2 001 SK AM69; DsnPath: C:\Users\danie\Downloads\sprr466c\PROC154E3_RP\PROC154E3_SCH.DSN; SchematicName: SCHEMATIC1; PageName: 08. SOC GPIO_MAPPING_TABLE; PageSize: C; TopSchematic: True
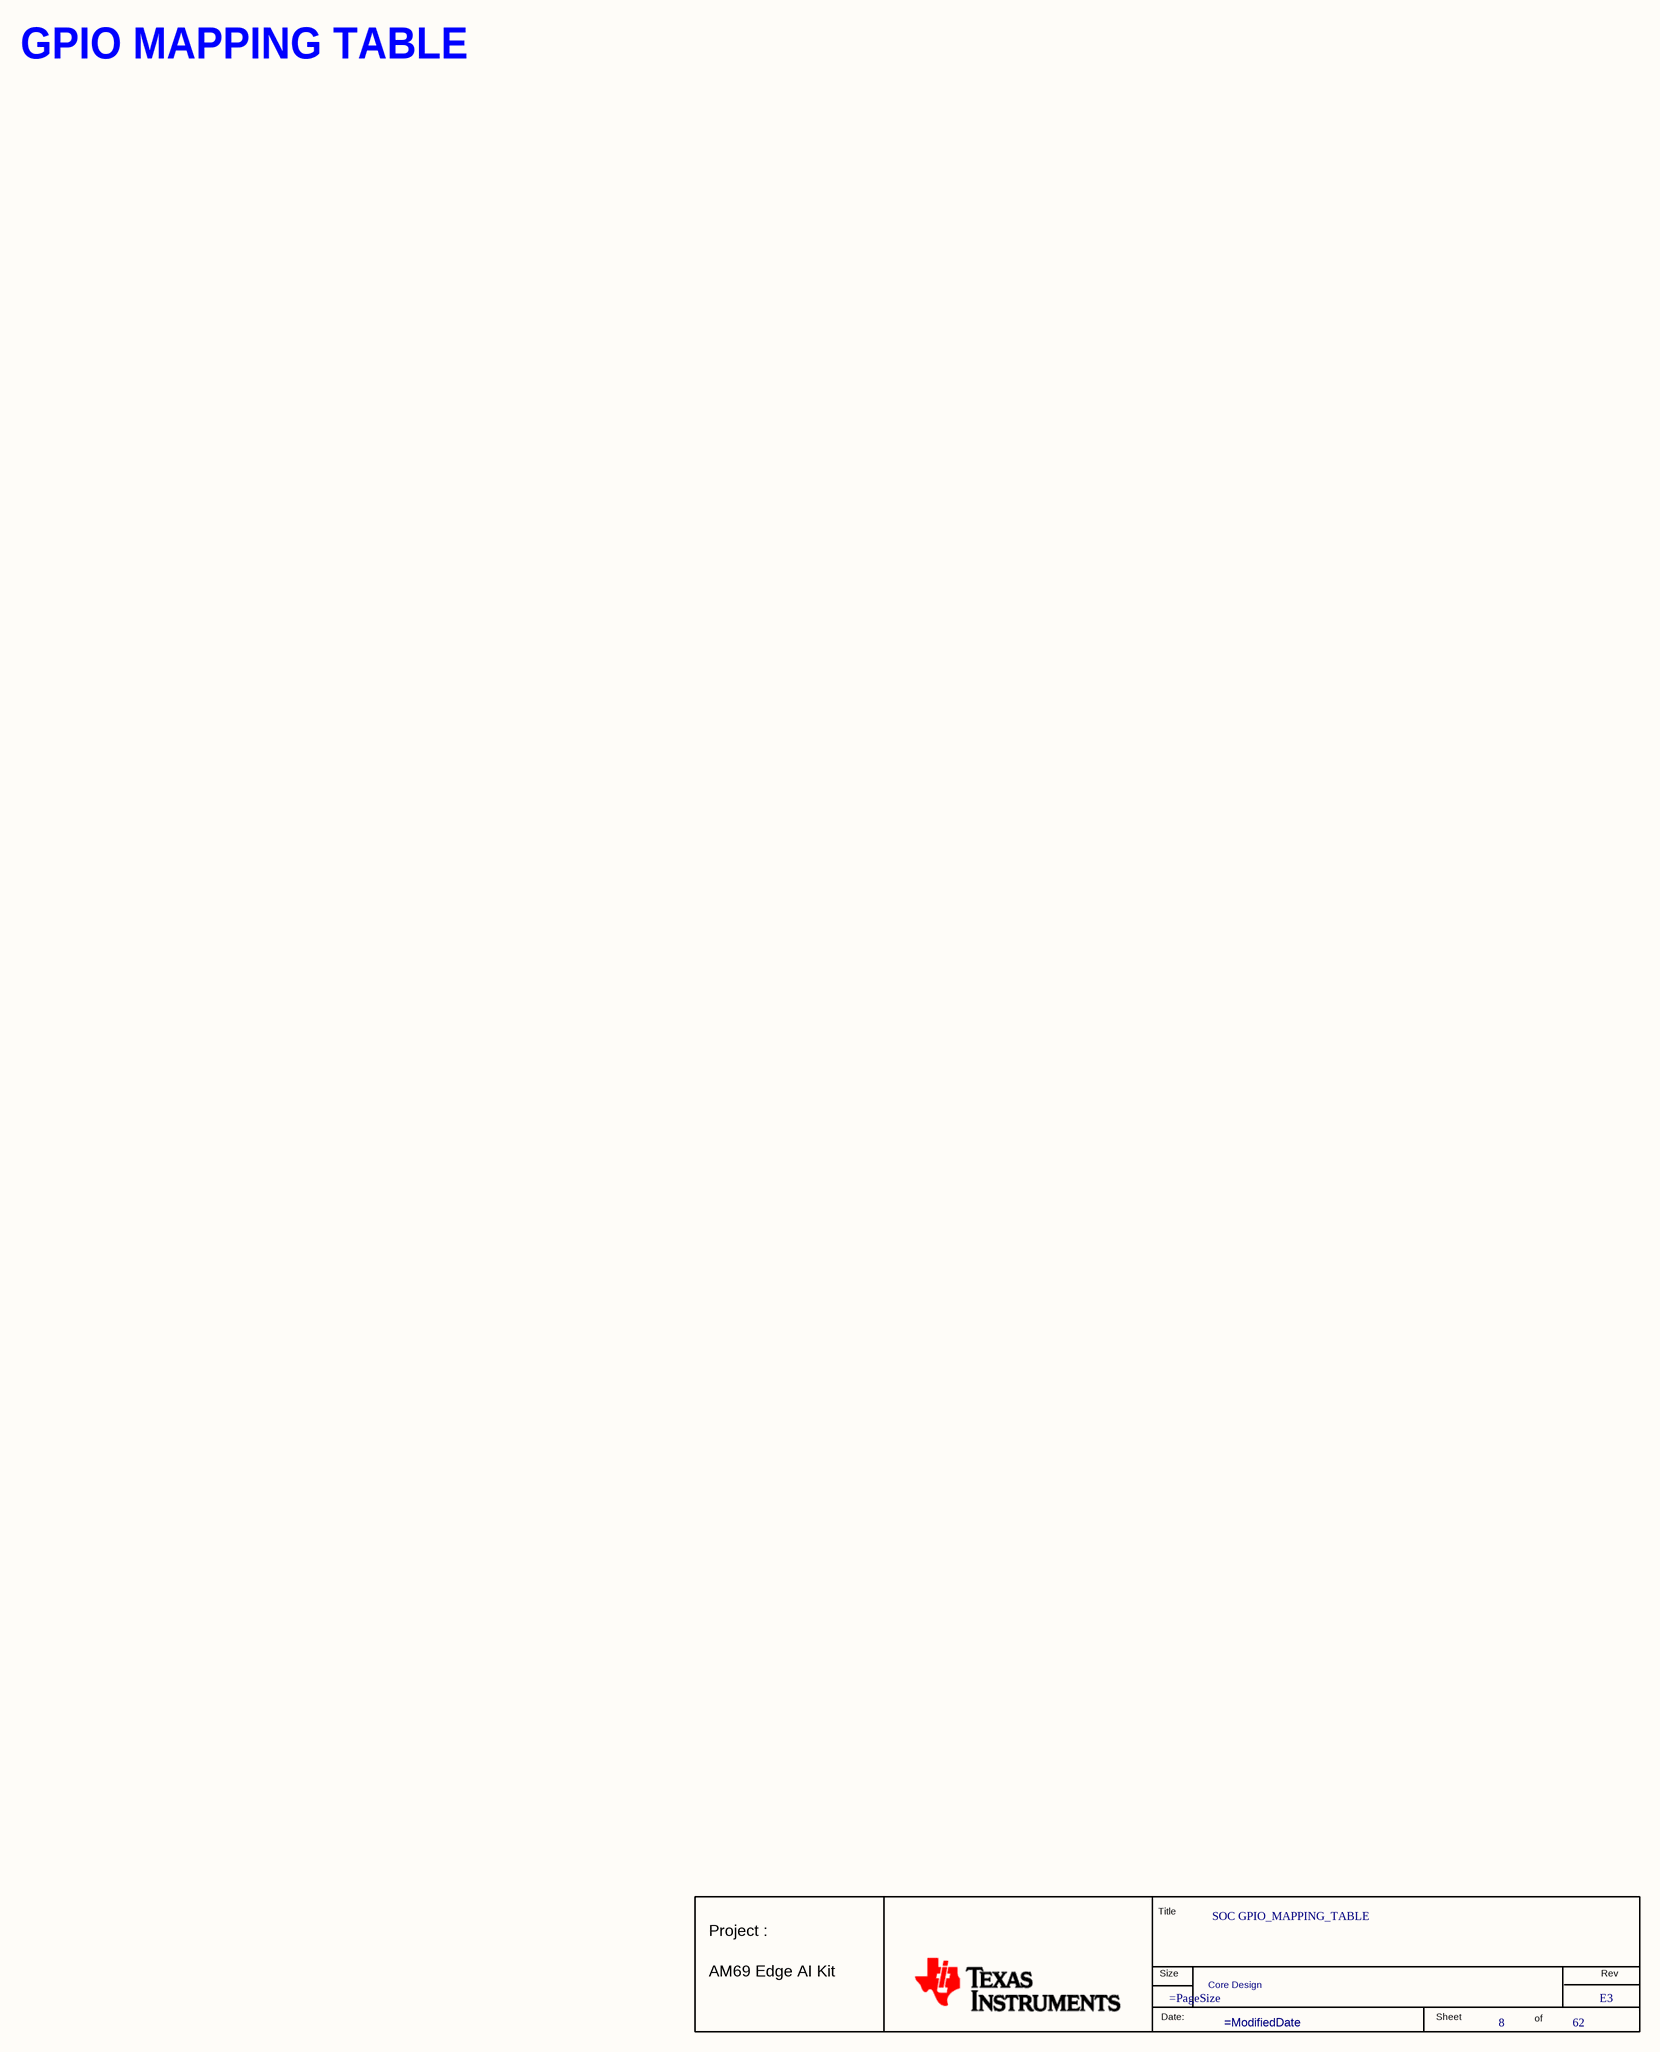
[diagram p8: 08. SOC GPIO_MAPPING_TABLE.SchDoc]

### Parts
(Parts that share a designator on the sheet are numbered #1, #2 ... from top to bottom, then left to right.)
*#8  RevCode: E3  Title: SOC GPIO_MAPPING_TABLE  Page Number: 8  Page Count: 62  Variant Name: Core Design  (hidden comment: MISTRAL_TITLEBLK_CSIZE_1)  (graphical)

### Notes on the sheet
- GPIO MAPPING TABLE
- (in symbol MISTRAL_TITLEBLK_CSIZE_1) Title; Project :; Size; Rev; AM69 Edge AI Kit; Date:; Sheet; of

### Library data of the parts
*#8 = MISTRAL_TITLEBLK_CSIZE_1: as *#2 on sheet 02. REVISION HISTORY; Page Create Date: March  8, 1995; Page Size: =PageSize; Page Modify Date: =ModifiedDate; Schematic Page Count: 62; Schematic Page Number: 8

## Sheet 09. SOC CSI & DSI IF.SchDoc: CSI & DSI INTERFACE
size 513 x 386 mm; Project: PROC154E2(001)_SK_AM69; Issue: 1.0; RevCode: E3; Page Create Date: March  8, 1995; Variant Name: Core Design; Schematic Page Number: 9; Page Number: 9; Page Size: C; Comment: MISTRAL_TITLEBLK_CSIZE_1; Page Count: 62; Schematic Page Count: 62; Name: PROC154E2 001 SK AM69; DsnPath: C:\Users\danie\Downloads\sprr466c\PROC154E3_RP\PROC154E3_SCH.DSN; SchematicName: SCHEMATIC1; PageName: 09. SOC CSI & DSI IF; PageSize: C; TopSchematic: True
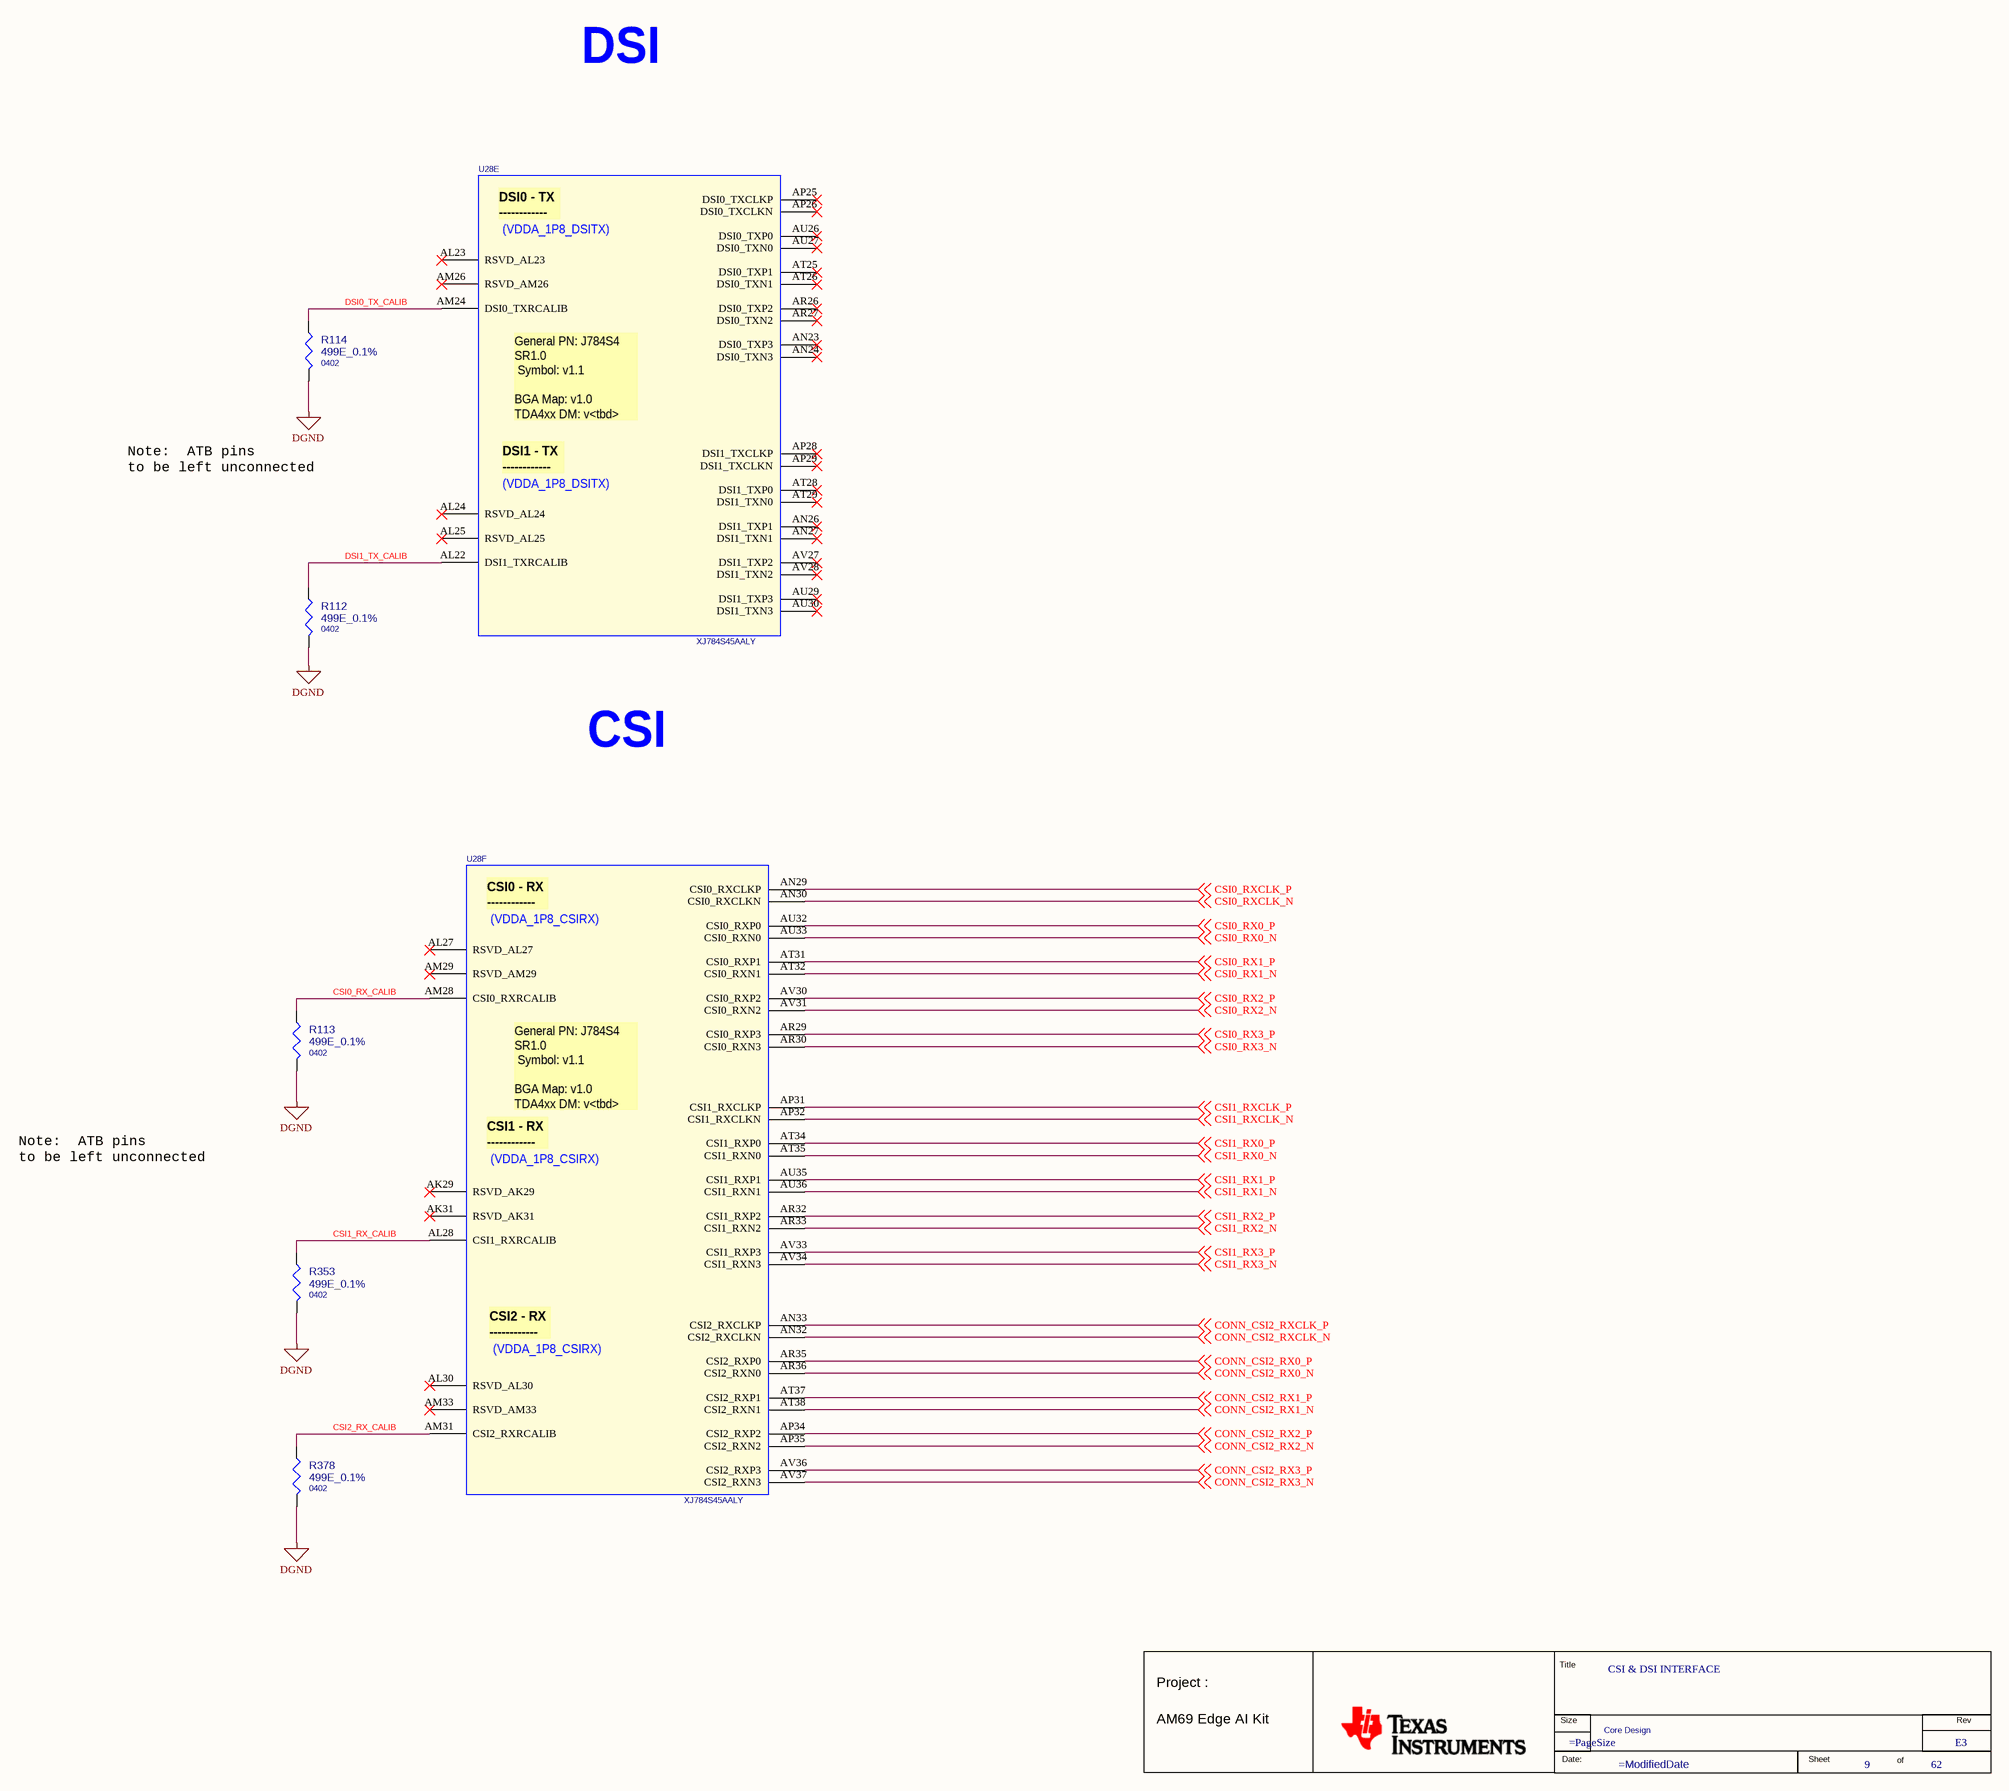
[diagram p9: 09. SOC CSI & DSI IF.SchDoc]

### Parts
(Parts that share a designator on the sheet are numbered #1, #2 ... from top to bottom, then left to right.)
*#9  RevCode: E3  Title: CSI & DSI INTERFACE  Page Number: 9  Page Count: 62  Variant Name: Core Design  (hidden comment: MISTRAL_TITLEBLK_CSIZE_1)  (graphical)
R112  499E_0.1%  Package: 0402  [RES0402_0-5]
R113  499E_0.1%  Package: 0402  [RES0402_0-5]
R114  499E_0.1%  Package: 0402  [RES0402_0-5]
R353  499E_0.1%  Package: 0402  [RES0402_0-5]
R378  499E_0.1%  Package: 0402  [RES0402_0-5]
U28  XJ784S45AALY  [BGA1414_31-49_1230X1230_2-7]  (parts E,F of 26)

### Nets
DGND: R112.2 R113.2 R114.2 R353.2 R378.2  [project net VDD_CPU_HCPS_GOSNS]
CONN_CSI2_RX0_N: U28.AR36(CSI2_RXN0) ; off-sheet CONN_CSI2_RX0_N
CONN_CSI2_RX0_P: U28.AR35(CSI2_RXP0) ; off-sheet CONN_CSI2_RX0_P
CONN_CSI2_RX1_N: U28.AT38(CSI2_RXN1) ; off-sheet CONN_CSI2_RX1_N
CONN_CSI2_RX1_P: U28.AT37(CSI2_RXP1) ; off-sheet CONN_CSI2_RX1_P
CONN_CSI2_RX2_N: U28.AP35(CSI2_RXN2) ; off-sheet CONN_CSI2_RX2_N
CONN_CSI2_RX2_P: U28.AP34(CSI2_RXP2) ; off-sheet CONN_CSI2_RX2_P
CONN_CSI2_RX3_N: U28.AV37(CSI2_RXN3) ; off-sheet CONN_CSI2_RX3_N
CONN_CSI2_RX3_P: U28.AV36(CSI2_RXP3) ; off-sheet CONN_CSI2_RX3_P
CONN_CSI2_RXCLK_N: U28.AN32(CSI2_RXCLKN) ; off-sheet CONN_CSI2_RXCLK_N
CONN_CSI2_RXCLK_P: U28.AN33(CSI2_RXCLKP) ; off-sheet CONN_CSI2_RXCLK_P
CSI0_RX0_N: U28.AU33(CSI0_RXN0) ; off-sheet CSI0_RX0_N
CSI0_RX0_P: U28.AU32(CSI0_RXP0) ; off-sheet CSI0_RX0_P
CSI0_RX1_N: U28.AT32(CSI0_RXN1) ; off-sheet CSI0_RX1_N
CSI0_RX1_P: U28.AT31(CSI0_RXP1) ; off-sheet CSI0_RX1_P
CSI0_RX2_N: U28.AV31(CSI0_RXN2) ; off-sheet CSI0_RX2_N
CSI0_RX2_P: U28.AV30(CSI0_RXP2) ; off-sheet CSI0_RX2_P
CSI0_RX3_N: U28.AR30(CSI0_RXN3) ; off-sheet CSI0_RX3_N
CSI0_RX3_P: U28.AR29(CSI0_RXP3) ; off-sheet CSI0_RX3_P
CSI0_RX_CALIB: R113.1 U28.AM28(CSI0_RXRCALIB)
CSI0_RXCLK_N: U28.AN30(CSI0_RXCLKN) ; off-sheet CSI0_RXCLK_N
CSI0_RXCLK_P: U28.AN29(CSI0_RXCLKP) ; off-sheet CSI0_RXCLK_P
CSI1_RX0_N: U28.AT35(CSI1_RXN0) ; off-sheet CSI1_RX0_N
CSI1_RX0_P: U28.AT34(CSI1_RXP0) ; off-sheet CSI1_RX0_P
CSI1_RX1_N: U28.AU36(CSI1_RXN1) ; off-sheet CSI1_RX1_N
CSI1_RX1_P: U28.AU35(CSI1_RXP1) ; off-sheet CSI1_RX1_P
CSI1_RX2_N: U28.AR33(CSI1_RXN2) ; off-sheet CSI1_RX2_N
CSI1_RX2_P: U28.AR32(CSI1_RXP2) ; off-sheet CSI1_RX2_P
CSI1_RX3_N: U28.AV34(CSI1_RXN3) ; off-sheet CSI1_RX3_N
CSI1_RX3_P: U28.AV33(CSI1_RXP3) ; off-sheet CSI1_RX3_P
CSI1_RX_CALIB: R353.1 U28.AL28(CSI1_RXRCALIB)
CSI1_RXCLK_N: U28.AP32(CSI1_RXCLKN) ; off-sheet CSI1_RXCLK_N
CSI1_RXCLK_P: U28.AP31(CSI1_RXCLKP) ; off-sheet CSI1_RXCLK_P
CSI2_RX_CALIB: R378.1 U28.AM31(CSI2_RXRCALIB)
DSI0_TX_CALIB: R114.1 U28.AM24(DSI0_TXRCALIB)
DSI1_TX_CALIB: R112.1 U28.AL22(DSI1_TXRCALIB)

Not connected (* = marked no-connect by the designer): U28 AK29(RSVD_AK29)* AK31(RSVD_AK31)* AL23(RSVD_AL23)* AL24(RSVD_AL24)* AL25(RSVD_AL25)* AL27(RSVD_AL27)* AL30(RSVD_AL30)* AM26(RSVD_AM26)* AM29(RSVD_AM29)* AM33(RSVD_AM33)* AN23(DSI0_TXP3)* AN24(DSI0_TXN3)* AN26(DSI1_TXP1)* AN27(DSI1_TXN1)* AP25(DSI0_TXCLKP)* AP26(DSI0_TXCLKN)* AP28(DSI1_TXCLKP)* AP29(DSI1_TXCLKN)* AR26(DSI0_TXP2)* AR27(DSI0_TXN2)* AT25(DSI0_TXP1)* AT26(DSI0_TXN1)* AT28(DSI1_TXP0)* AT29(DSI1_TXN0)* AU26(DSI0_TXP0)* AU27(DSI0_TXN0)* AU29(DSI1_TXP3)* AU30(DSI1_TXN3)* AV27(DSI1_TXP2)* AV28(DSI1_TXN2)*

### Notes on the sheet
- DSI
- Note:  ATB pins
  to be left unconnected
- CSI
- (in symbol J7AHPSoC-EVM_BGA1414, part E) DSI0 - TX / ------------; (VDDA_1P8_DSITX); General PN: J784S4 / SR1.0 / Symbol: v1.1 / BGA Map: v1.0 / TDA4xx DM: v<tbd>; DSI1 - TX / ------------
- (in symbol J7AHPSoC-EVM_BGA1414, part F) CSI0 - RX / ------------; (VDDA_1P8_CSIRX); General PN: J784S4 / SR1.0 / Symbol: v1.1 / BGA Map: v1.0 / TDA4xx DM: v<tbd>; CSI1 - RX / ------------; CSI2 - RX / ------------
- (in symbol MISTRAL_TITLEBLK_CSIZE_1) Title; Project :; Size; Rev; AM69 Edge AI Kit; Date:; Sheet; of

### Library data of the parts
*#9 = MISTRAL_TITLEBLK_CSIZE_1: as *#2 on sheet 02. REVISION HISTORY; Page Create Date: March  8, 1995; Page Size: =PageSize; Page Modify Date: =ModifiedDate; Schematic Page Count: 62; Schematic Page Number: 9
R112 = RESISTOR_Dup2: RES 499E 1/16W 0.1% 0402; Part Reference: R112; Mfr_name: YAGEO AMERICA; Part_type: RESISTORS\FIXED; Mfr_part_number: RT0402BRD07499RL; Mistral Part No: 110021020006-R; Custom_Duty: 15%; Customs_HS_Code: 85332119; Voltage: NA; Project: TI_AM62x SKEVM_BRD; Value: 499E_0.1%; PCB Footprint: RES0402_0-5; Footprint Path: Y:\MIS_DATABASE\Library\ALTIUM_TOOL\PCB_FOOTPRINTS\Altium_Footprint_Lib.PcbLib; Library Path: Y:\MIS_DATABASE\Library\ALTIUM_TOOL\SCHEMATICS_PARTS\MS_DISCRETE_Library.schlib; MECHANICAL 3D STEP FILE: RES0402_0-5; Chkd/date: ALVY/200921; Crtd /date: MANIRAJA/200921; Datasheet: Y:\MIS_DATABASE\DATASHEETS\RESISTORS\YAGEO_RT-SERIES.PDF; Temperature: -55°C+155°C; Weight: 0.65mg; Height: 0.35MM; Library Ref: RESISTOR; Distributor_part_number: YAG1440CT-ND; Distributor_name: DIGIKEY; Wattage: 1/16W; Tolerance: 0.1%; Manufacturer: YAGEO AMERICA; Footprint Ref: RES0402_0-5
R113 = RESISTOR_Dup2: RES 499E 1/16W 0.1% 0402; Part Reference: R113; Mfr_name: YAGEO AMERICA; Mistral Part No: 110021020006-R; Mfr_part_number: RT0402BRD07499RL; Part_type: RESISTORS\FIXED; Project: TI_AM62x SKEVM_BRD; Voltage: NA; Customs_HS_Code: 85332119; Custom_Duty: 15%; Value: 499E_0.1%; PCB Footprint: RES0402_0-5; Footprint Ref: RES0402_0-5; Manufacturer: YAGEO AMERICA; Tolerance: 0.1%; Wattage: 1/16W; Distributor_name: DIGIKEY; Distributor_part_number: YAG1440CT-ND; Library Ref: RESISTOR; Height: 0.35MM; Weight: 0.65mg; Temperature: -55°C+155°C; Datasheet: Y:\MIS_DATABASE\DATASHEETS\RESISTORS\YAGEO_RT-SERIES.PDF; Crtd /date: MANIRAJA/200921; Chkd/date: ALVY/200921; MECHANICAL 3D STEP FILE: RES0402_0-5; Library Path: Y:\MIS_DATABASE\Library\ALTIUM_TOOL\SCHEMATICS_PARTS\MS_DISCRETE_Library.schlib; Footprint Path: Y:\MIS_DATABASE\Library\ALTIUM_TOOL\PCB_FOOTPRINTS\Altium_Footprint_Lib.PcbLib
R114 = RESISTOR_Dup2: RES 499E 1/16W 0.1% 0402; Part Reference: R114; Mfr_name: YAGEO AMERICA; Mistral Part No: 110021020006-R; Mfr_part_number: RT0402BRD07499RL; Part_type: RESISTORS\FIXED; Project: TI_AM62x SKEVM_BRD; Voltage: NA; Customs_HS_Code: 85332119; Custom_Duty: 15%; Value: 499E_0.1%; PCB Footprint: RES0402_0-5; Footprint Ref: RES0402_0-5; Manufacturer: YAGEO AMERICA; Tolerance: 0.1%; Wattage: 1/16W; Distributor_name: DIGIKEY; Distributor_part_number: YAG1440CT-ND; Library Ref: RESISTOR; Height: 0.35MM; Weight: 0.65mg; Temperature: -55°C+155°C; Datasheet: Y:\MIS_DATABASE\DATASHEETS\RESISTORS\YAGEO_RT-SERIES.PDF; Crtd /date: MANIRAJA/200921; Chkd/date: ALVY/200921; MECHANICAL 3D STEP FILE: RES0402_0-5; Library Path: Y:\MIS_DATABASE\Library\ALTIUM_TOOL\SCHEMATICS_PARTS\MS_DISCRETE_Library.schlib; Footprint Path: Y:\MIS_DATABASE\Library\ALTIUM_TOOL\PCB_FOOTPRINTS\Altium_Footprint_Lib.PcbLib
R353 = RESISTOR_Dup2: RES 499E 1/16W 0.1% 0402; Part Reference: R353; Mfr_name: YAGEO AMERICA; Part_type: RESISTORS\FIXED; Mfr_part_number: RT0402BRD07499RL; Mistral Part No: 110021020006-R; Custom_Duty: 15%; Customs_HS_Code: 85332119; Voltage: NA; Project: TI_AM62x SKEVM_BRD; Value: 499E_0.1%; PCB Footprint: RES0402_0-5; Footprint Path: Y:\MIS_DATABASE\Library\ALTIUM_TOOL\PCB_FOOTPRINTS\Altium_Footprint_Lib.PcbLib; Library Path: Y:\MIS_DATABASE\Library\ALTIUM_TOOL\SCHEMATICS_PARTS\MS_DISCRETE_Library.schlib; MECHANICAL 3D STEP FILE: RES0402_0-5; Chkd/date: ALVY/200921; Crtd /date: MANIRAJA/200921; Datasheet: Y:\MIS_DATABASE\DATASHEETS\RESISTORS\YAGEO_RT-SERIES.PDF; Temperature: -55°C+155°C; Weight: 0.65mg; Height: 0.35MM; Library Ref: RESISTOR; Distributor_part_number: YAG1440CT-ND; Distributor_name: DIGIKEY; Wattage: 1/16W; Tolerance: 0.1%; Manufacturer: YAGEO AMERICA; Footprint Ref: RES0402_0-5
R378 = RESISTOR_Dup2: RES 499E 1/16W 0.1% 0402; Part Reference: R378; Mfr_name: YAGEO AMERICA; Part_type: RESISTORS\FIXED; Mfr_part_number: RT0402BRD07499RL; Mistral Part No: 110021020006-R; Custom_Duty: 15%; Customs_HS_Code: 85332119; Voltage: NA; Project: TI_AM62x SKEVM_BRD; Value: 499E_0.1%; PCB Footprint: RES0402_0-5; Footprint Path: Y:\MIS_DATABASE\Library\ALTIUM_TOOL\PCB_FOOTPRINTS\Altium_Footprint_Lib.PcbLib; Library Path: Y:\MIS_DATABASE\Library\ALTIUM_TOOL\SCHEMATICS_PARTS\MS_DISCRETE_Library.schlib; MECHANICAL 3D STEP FILE: RES0402_0-5; Chkd/date: ALVY/200921; Crtd /date: MANIRAJA/200921; Datasheet: Y:\MIS_DATABASE\DATASHEETS\RESISTORS\YAGEO_RT-SERIES.PDF; Temperature: -55°C+155°C; Weight: 0.65mg; Height: 0.35MM; Library Ref: RESISTOR; Distributor_part_number: YAG1440CT-ND; Distributor_name: DIGIKEY; Wattage: 1/16W; Tolerance: 0.1%; Manufacturer: YAGEO AMERICA; Footprint Ref: RES0402_0-5
U28 = J7AHPSoC-EVM_BGA1414: IC AM69 SoC EVM MICROPROCESSOR BGA1414; Part Reference: U28; Manufacturer: TEXAS INSTRUMENTS; Mistral Part No: 141230020002; Part_type: ICS\DIGITAL\MICROPROCESSOR; SPLIT_INST: TRUE; SWAP_INFO: (S1+S2+S3+S4+S5+S6+S7+S8+S9+S10+S11+S12+S13+S14+S15+S16+S17+S18+S19+S20+S21+S22+S23+S24+S25+S26); Project: TI_J7AHP SK_BRD; Tolerance: NA; Customs_HS_Code: 85423100; Custom_Duty: 15%; Value: XJ784S45AALY; Footprint Ref: BGA1414_31-49_1230X1230_2-7; Mfr_name: TEXAS INSTRUMENTS; Mfr_part_number: XJ784S45AALY; Voltage: NA; Wattage: NA; Package: BGA1414; Distributor_name: NA; Distributor_part_number: NA; Library Ref: J7AHPSoC-EVM_BGA1414; Height: 2.70MM; Weight: NA; Temperature: NA; Datasheet: Y:\MIS_DATABASE\DATASHEETS\ICS\DIGITAL\MICROCONTROLLER\J7AHP-SoC-EVM.PDF; Crtd /date: ALVY/141221; Chkd/date: MANIRAJA/151221; RoHS: NA; MECHANICAL 3D STEP FILE: BGA1414_31-49_1230X1230_2-7; Library Path: Y:\MIS_DATABASE\Library\ALTIUM_TOOL\SCHEMATICS_PARTS\MS_MICROPROCESSOR_Library.schlib; Footprint Path: Y:\MIS_DATABASE\Library\ALTIUM_TOOL\PCB_FOOTPRINTS\Altium_Footprint_Lib.PcbLib; PCB Footprint: BGA1414_31-49_1230X1230_2-7

## Sheet 10. SOC SERDES0 IF.SchDoc: SERDES INTERFACE-1
size 513 x 386 mm; Project: PROC154E2(001)_SK_AM69; Issue: 1.0; RevCode: E3; Page Create Date: March  8, 1995; Variant Name: Core Design; Schematic Page Number: 10; Page Number: 10; Page Size: C; Comment: MISTRAL_TITLEBLK_CSIZE_1; Page Count: 62; Schematic Page Count: 62; Name: PROC154E2 001 SK AM69; DsnPath: C:\Users\danie\Downloads\sprr466c\PROC154E3_RP\PROC154E3_SCH.DSN; SchematicName: SCHEMATIC1; PageName: 10. SOC SERDES0 IF; PageSize: C; TopSchematic: True
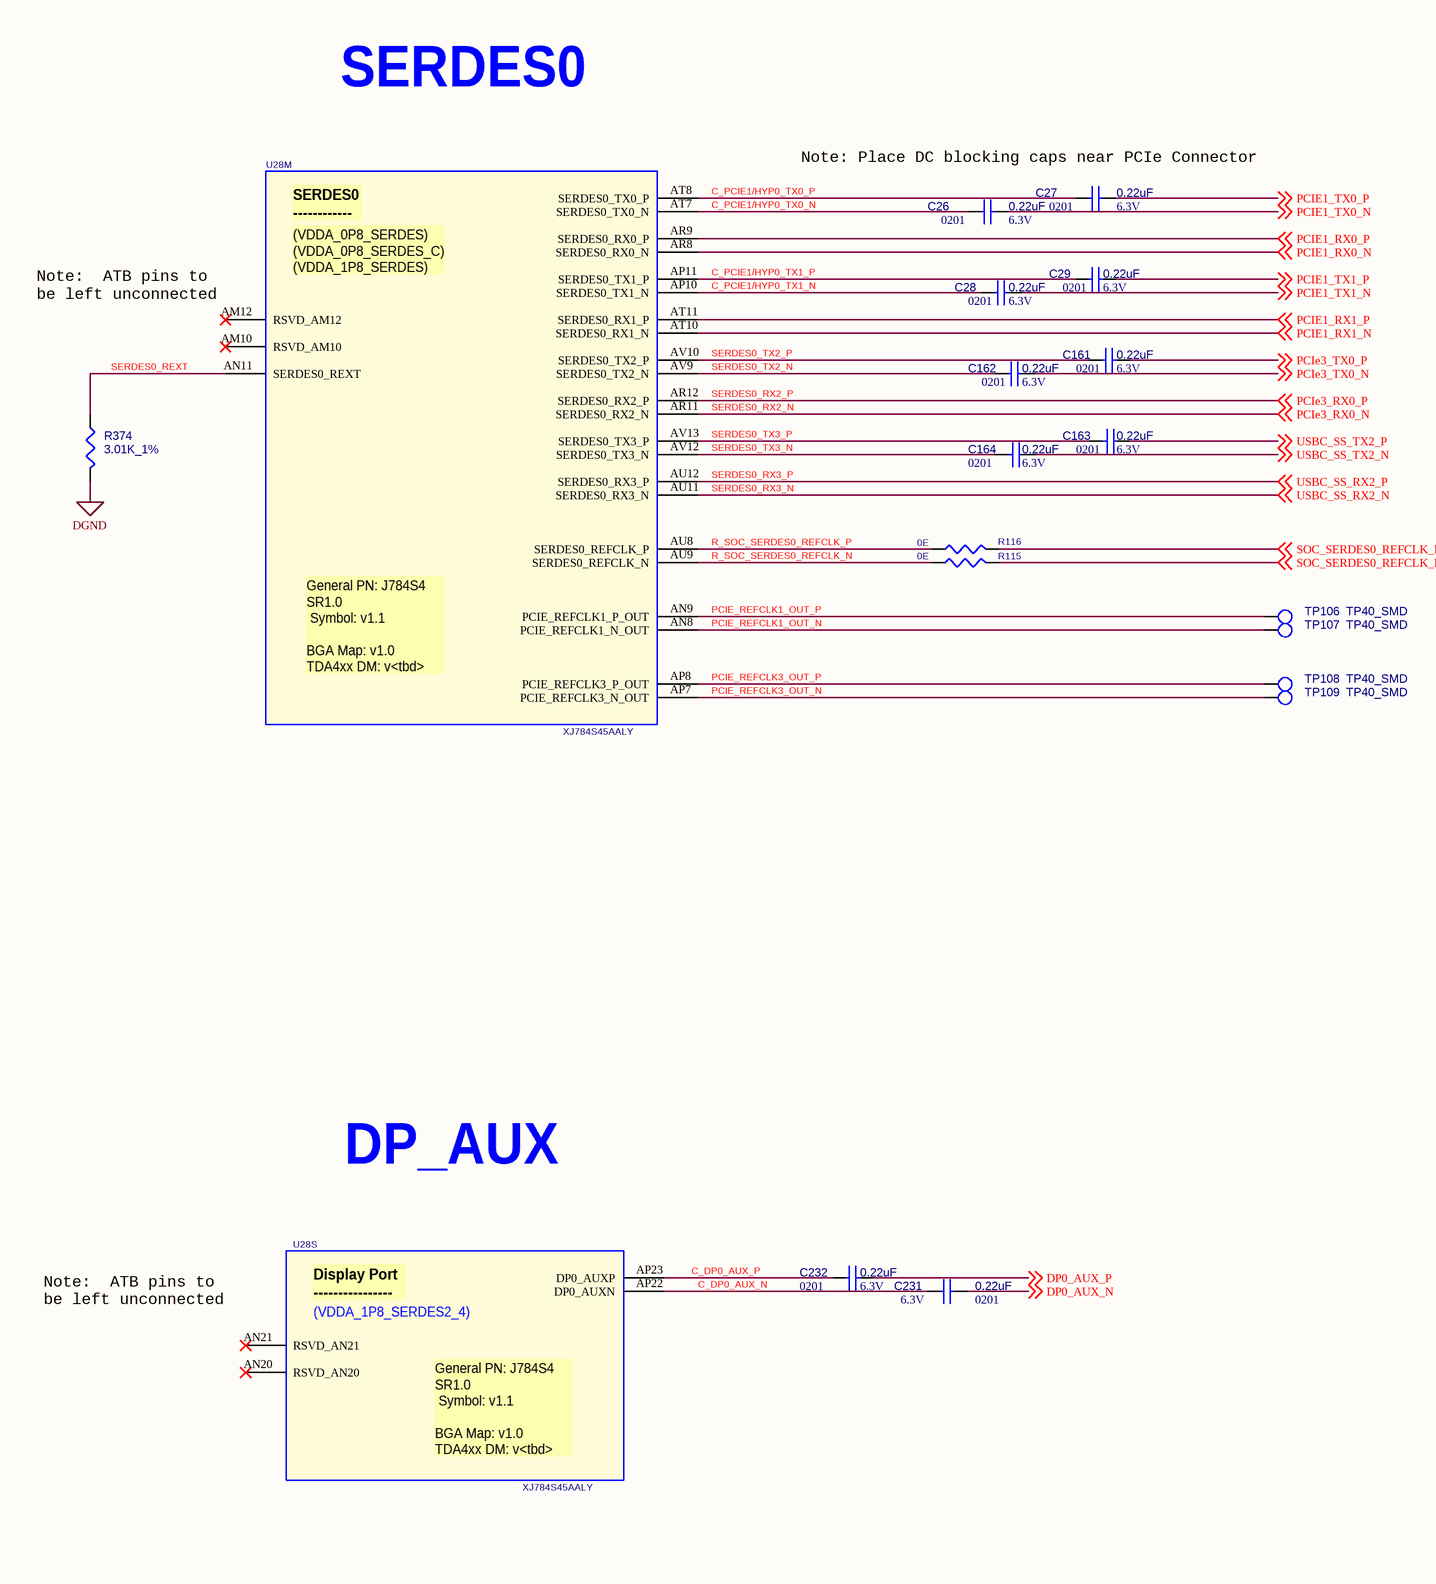
[diagram p10: 10. SOC SERDES0 IF.SchDoc, left]
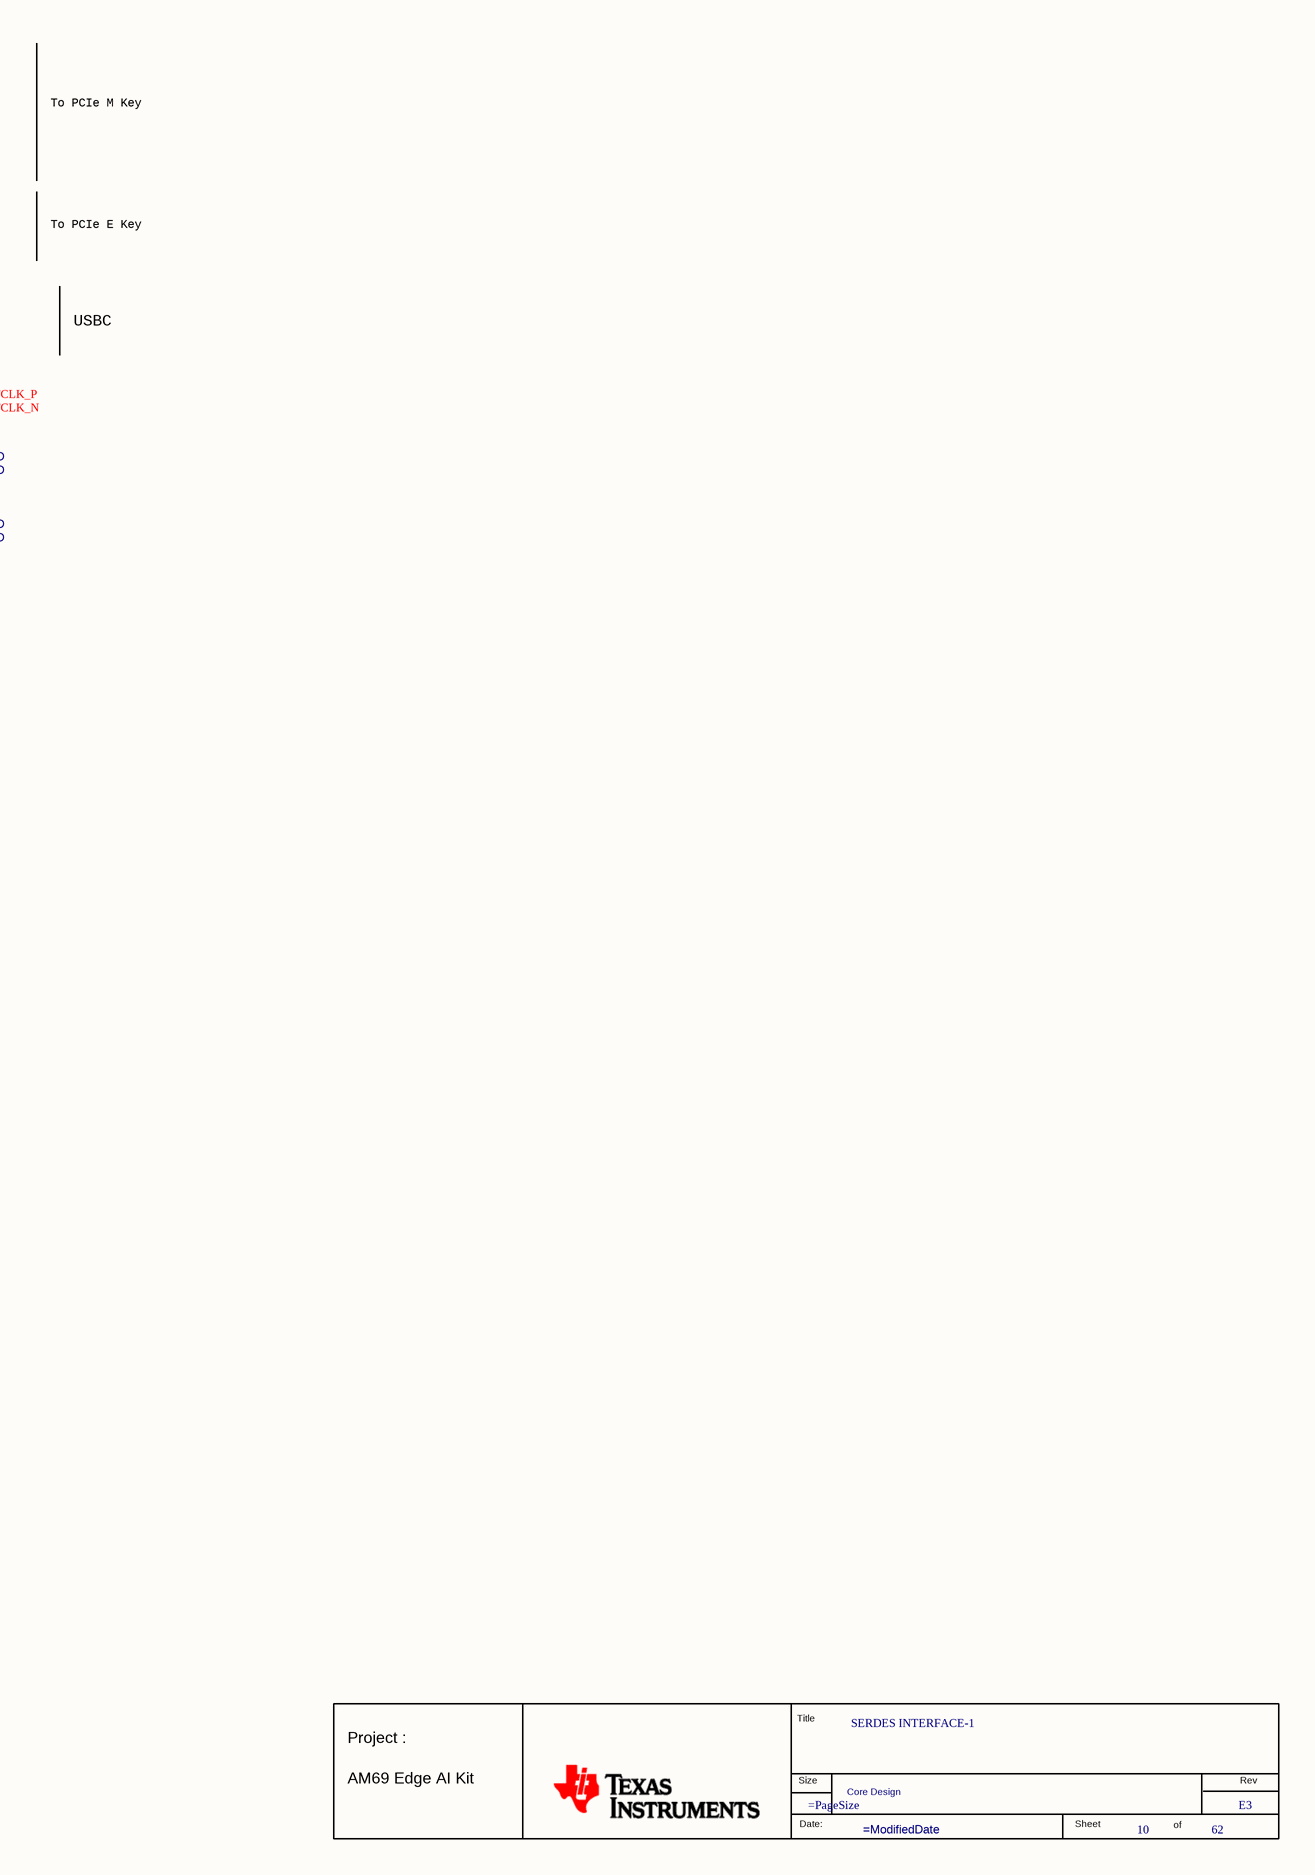
[diagram p11: 10. SOC SERDES0 IF.SchDoc, right]

### Parts
(Parts that share a designator on the sheet are numbered #1, #2 ... from top to bottom, then left to right.)
*#10  RevCode: E3  Title: SERDES INTERFACE-1  Page Number: 10  Page Count: 62  Variant Name: Core Design  (hidden comment: MISTRAL_TITLEBLK_CSIZE_1)  (graphical)
C26  0.22uF  Package: 0201  Voltage: 6.3V  [CAP0201_0-5]
C27  0.22uF  Voltage: 6.3V  Package: 0201  [CAP0201_0-5]
C28  0.22uF  Package: 0201  Voltage: 6.3V  [CAP0201_0-5]
C29  0.22uF  Package: 0201  Voltage: 6.3V  [CAP0201_0-5]
C161  0.22uF  Voltage: 6.3V  Package: 0201  [CAP0201_0-5]
C162  0.22uF  Voltage: 6.3V  Package: 0201  [CAP0201_0-5]
C163  0.22uF  Package: 0201  Voltage: 6.3V  [CAP0201_0-5]
C164  0.22uF  Voltage: 6.3V  Package: 0201  [CAP0201_0-5]
C231  0.22uF  Voltage: 6.3V  Package: 0201  [CAP0201_0-5]
C232  0.22uF  Package: 0201  Voltage: 6.3V  [CAP0201_0-5]
R115  0E  [RES0201_0-5]
R116  0E  [RES0201_0-5]
R374  3.01K_1%  [RES0201_0-5]
TP106  TP40_SMD  [TP40_SMD]
TP107  TP40_SMD  [TP40_SMD]
TP108  TP40_SMD  [TP40_SMD]
TP109  TP40_SMD  [TP40_SMD]
U28  XJ784S45AALY  [BGA1414_31-49_1230X1230_2-7]  (parts M,S of 26)

### Nets
DGND: R374.2  [project net VDD_CPU_HCPS_GOSNS]
C_DP0_AUX_N: C231.1 U28.AP22(DP0_AUXN)
C_DP0_AUX_P: C232.1 U28.AP23(DP0_AUXP)
C_PCIE1/HYP0_TX0_N: C26.1 U28.AT7(SERDES0_TX0_N)
C_PCIE1/HYP0_TX0_P: C27.1 U28.AT8(SERDES0_TX0_P)
C_PCIE1/HYP0_TX1_N: C28.1 U28.AP10(SERDES0_TX1_N)
C_PCIE1/HYP0_TX1_P: C29.1 U28.AP11(SERDES0_TX1_P)
DP0_AUX_N: C231.2 ; off-sheet DP0_AUX_N
DP0_AUX_P: C232.2 ; off-sheet DP0_AUX_P
PCIE1_RX0_N: U28.AR8(SERDES0_RX0_N) ; off-sheet PCIE1_RX0_N
PCIE1_RX0_P: U28.AR9(SERDES0_RX0_P) ; off-sheet PCIE1_RX0_P
PCIE1_RX1_N: U28.AT10(SERDES0_RX1_N) ; off-sheet PCIE1_RX1_N
PCIE1_RX1_P: U28.AT11(SERDES0_RX1_P) ; off-sheet PCIE1_RX1_P
PCIE1_TX0_N: C26.2 ; off-sheet PCIE1_TX0_N
PCIE1_TX0_P: C27.2 ; off-sheet PCIE1_TX0_P
PCIE1_TX1_N: C28.2 ; off-sheet PCIE1_TX1_N
PCIE1_TX1_P: C29.2 ; off-sheet PCIE1_TX1_P
PCIe3_TX0_N: C162.2 ; off-sheet PCIe3_TX0_N
PCIe3_TX0_P: C161.2 ; off-sheet PCIe3_TX0_P
PCIE_REFCLK1_OUT_N: TP107.1(TP) U28.AN8(PCIE_REFCLK1_N_OUT)
PCIE_REFCLK1_OUT_P: TP106.1(TP) U28.AN9(PCIE_REFCLK1_P_OUT)
PCIE_REFCLK3_OUT_N: TP109.1(TP) U28.AP7(PCIE_REFCLK3_N_OUT)
PCIE_REFCLK3_OUT_P: TP108.1(TP) U28.AP8(PCIE_REFCLK3_P_OUT)
R_SOC_SERDES0_REFCLK_N: R115.2 U28.AU9(SERDES0_REFCLK_N)
R_SOC_SERDES0_REFCLK_P: R116.2 U28.AU8(SERDES0_REFCLK_P)
SERDES0_REXT: R374.1 U28.AN11(SERDES0_REXT)
SERDES0_RX2_N: U28.AR11(SERDES0_RX2_N) ; off-sheet PCIe3_RX0_N  [also labelled PCIe3_RX0_N]
SERDES0_RX2_P: U28.AR12(SERDES0_RX2_P) ; off-sheet PCIe3_RX0_P  [also labelled PCIe3_RX0_P]
SERDES0_RX3_N: U28.AU11(SERDES0_RX3_N) ; off-sheet USBC_SS_RX2_N  [also labelled USBC_SS_RX2_N]
SERDES0_RX3_P: U28.AU12(SERDES0_RX3_P) ; off-sheet USBC_SS_RX2_P  [also labelled USBC_SS_RX2_P]
SERDES0_TX2_N: C162.1 U28.AV9(SERDES0_TX2_N)
SERDES0_TX2_P: C161.1 U28.AV10(SERDES0_TX2_P)
SERDES0_TX3_N: C164.2 U28.AV12(SERDES0_TX3_N)
SERDES0_TX3_P: C163.2 U28.AV13(SERDES0_TX3_P)
SOC_SERDES0_REFCLK_N: R115.1 ; off-sheet SOC_SERDES0_REFCLK_N
SOC_SERDES0_REFCLK_P: R116.1 ; off-sheet SOC_SERDES0_REFCLK_P
USBC_SS_TX2_N: C164.1 ; off-sheet USBC_SS_TX2_N
USBC_SS_TX2_P: C163.1 ; off-sheet USBC_SS_TX2_P

Not connected (* = marked no-connect by the designer): U28 AM10(RSVD_AM10)* AM12(RSVD_AM12)* AN20(RSVD_AN20)* AN21(RSVD_AN21)*

### Notes on the sheet
- SERDES0
- Note: Place DC blocking caps near PCIe Connector
- (near U28) Note:  ATB pins to
  be left unconnected
- To PCIe M Key
- To PCIe E Key
- USBC
- DP_AUX
- (in symbol J7AHPSoC-EVM_BGA1414, part M) SERDES0 / ------------; (VDDA_0P8_SERDES) / (VDDA_0P8_SERDES_C) / (VDDA_1P8_SERDES); General PN: J784S4 / SR1.0 / Symbol: v1.1 / BGA Map: v1.0 / TDA4xx DM: v<tbd>
- (in symbol J7AHPSoC-EVM_BGA1414, part S) Display Port / ----------------; (VDDA_1P8_SERDES2_4); General PN: J784S4 / SR1.0 / Symbol: v1.1 / BGA Map: v1.0 / TDA4xx DM: v<tbd>
- (in symbol MISTRAL_TITLEBLK_CSIZE_1) Title; Project :; Size; Rev; AM69 Edge AI Kit; Date:; Sheet; of

### Library data of the parts
*#10 = MISTRAL_TITLEBLK_CSIZE_1: as *#2 on sheet 02. REVISION HISTORY; Page Create Date: March  8, 1995; Page Size: =PageSize; Page Modify Date: =ModifiedDate; Schematic Page Count: 62; Schematic Page Number: 10
C26 = CAP_Dup1: CAP CERAMIC 0.22uF 6.3V 10% X6S AUTO 0201; Part Reference: C26; Manufacturer: MURATA; Part_type: CAPACITORS\CERAMIC; Mfr_part_number: GRT033C80J224KE01D; Mistral Part No: 120019020011-R; Custom_Duty: 15%; Customs_HS_Code: 85322990; Wattage: NA; Project: TI_J7ES_EVM_SOM; SIGNAL_MODEL: CAP_CAP0201_0-5_0.22UF_0.22uF; Value: 0.22uF; Chkd/date: MANIRAJA/220219; Crtd /date: ALVY/220219; Datasheet: Y:\MIS_DATABASE\DATASHEETS\CAPACITORS\MURATA-GCM-SER.PDF; Temperature: -55°C+105°C; Weight: 0.17mg; Height: 0.33MM; Library Ref: CAP; Distributor_part_number: 490-12230-1-ND; Distributor_name: DIGIKEY; Tolerance: 10%; Mfr_name: MURATA; MECHANICAL 3D STEP FILE: CAP0201_0-5; Footprint Ref: CAP0201_0-5; Library Path: Y:\MIS_DATABASE\Library\ALTIUM_TOOL\SCHEMATICS_PARTS\MS_DISCRETE_Library.schlib; Footprint Path: Y:\MIS_DATABASE\Library\ALTIUM_TOOL\PCB_FOOTPRINTS\Altium_Footprint_Lib.PcbLib; PCB Footprint: CAP0201_0-5
C27 = CAP_Dup1: CAP CERAMIC 0.22uF 6.3V 10% X6S AUTO 0201; Part Reference: C27; Manufacturer: MURATA; Mistral Part No: 120019020011-R; Mfr_part_number: GRT033C80J224KE01D; Part_type: CAPACITORS\CERAMIC; Project: TI_J7ES_EVM_SOM; Wattage: NA; Customs_HS_Code: 85322990; Custom_Duty: 15%; SIGNAL_MODEL: CAP_CAP0201_0-5_0.22UF_0.22uF; Value: 0.22uF; MECHANICAL 3D STEP FILE: CAP0201_0-5; Mfr_name: MURATA; Tolerance: 10%; Distributor_name: DIGIKEY; Distributor_part_number: 490-12230-1-ND; Library Ref: CAP; Height: 0.33MM; Weight: 0.17mg; Temperature: -55°C+105°C; Datasheet: Y:\MIS_DATABASE\DATASHEETS\CAPACITORS\MURATA-GCM-SER.PDF; Crtd /date: ALVY/220219; Chkd/date: MANIRAJA/220219; Footprint Ref: CAP0201_0-5; Library Path: Y:\MIS_DATABASE\Library\ALTIUM_TOOL\SCHEMATICS_PARTS\MS_DISCRETE_Library.schlib; Footprint Path: Y:\MIS_DATABASE\Library\ALTIUM_TOOL\PCB_FOOTPRINTS\Altium_Footprint_Lib.PcbLib; PCB Footprint: CAP0201_0-5
C28 = CAP_Dup1: CAP CERAMIC 0.22uF 6.3V 10% X6S AUTO 0201; Part Reference: C28; Manufacturer: MURATA; Part_type: CAPACITORS\CERAMIC; Mfr_part_number: GRT033C80J224KE01D; Mistral Part No: 120019020011-R; Custom_Duty: 15%; Customs_HS_Code: 85322990; Wattage: NA; Project: TI_J7ES_EVM_SOM; SIGNAL_MODEL: CAP_CAP0201_0-5_0.22UF_0.22uF; Value: 0.22uF; Chkd/date: MANIRAJA/220219; Crtd /date: ALVY/220219; Datasheet: Y:\MIS_DATABASE\DATASHEETS\CAPACITORS\MURATA-GCM-SER.PDF; Temperature: -55°C+105°C; Weight: 0.17mg; Height: 0.33MM; Library Ref: CAP; Distributor_part_number: 490-12230-1-ND; Distributor_name: DIGIKEY; Tolerance: 10%; Mfr_name: MURATA; MECHANICAL 3D STEP FILE: CAP0201_0-5; Footprint Ref: CAP0201_0-5; Library Path: Y:\MIS_DATABASE\Library\ALTIUM_TOOL\SCHEMATICS_PARTS\MS_DISCRETE_Library.schlib; Footprint Path: Y:\MIS_DATABASE\Library\ALTIUM_TOOL\PCB_FOOTPRINTS\Altium_Footprint_Lib.PcbLib; PCB Footprint: CAP0201_0-5
C29 = CAP_Dup1: CAP CERAMIC 0.22uF 6.3V 10% X6S AUTO 0201; Part Reference: C29; Manufacturer: MURATA; Part_type: CAPACITORS\CERAMIC; Mfr_part_number: GRT033C80J224KE01D; Mistral Part No: 120019020011-R; Custom_Duty: 15%; Customs_HS_Code: 85322990; Wattage: NA; Project: TI_J7ES_EVM_SOM; SIGNAL_MODEL: CAP_CAP0201_0-5_0.22UF_0.22uF; Value: 0.22uF; Footprint Path: Y:\MIS_DATABASE\Library\ALTIUM_TOOL\PCB_FOOTPRINTS\Altium_Footprint_Lib.PcbLib; Library Path: Y:\MIS_DATABASE\Library\ALTIUM_TOOL\SCHEMATICS_PARTS\MS_DISCRETE_Library.schlib; Footprint Ref: CAP0201_0-5; Chkd/date: MANIRAJA/220219; Crtd /date: ALVY/220219; Datasheet: Y:\MIS_DATABASE\DATASHEETS\CAPACITORS\MURATA-GCM-SER.PDF; Temperature: -55°C+105°C; Weight: 0.17mg; Height: 0.33MM; Library Ref: CAP; Distributor_part_number: 490-12230-1-ND; Distributor_name: DIGIKEY; Tolerance: 10%; Mfr_name: MURATA; MECHANICAL 3D STEP FILE: CAP0201_0-5; PCB Footprint: CAP0201_0-5
C161 = CAP_Dup1: CAP CERAMIC 0.22uF 6.3V 10% X6S AUTO 0201; Part Reference: C161; Manufacturer: MURATA; Mistral Part No: 120019020011-R; Mfr_part_number: GRT033C80J224KE01D; Part_type: CAPACITORS\CERAMIC; Project: TI_J7ES_EVM_SOM; Wattage: NA; Customs_HS_Code: 85322990; Custom_Duty: 15%; Value: 0.22uF; Footprint Path: Y:\MIS_DATABASE\Library\ALTIUM_TOOL\PCB_FOOTPRINTS\Altium_Footprint_Lib.PcbLib; Library Path: Y:\MIS_DATABASE\Library\ALTIUM_TOOL\SCHEMATICS_PARTS\MS_DISCRETE_Library.schlib; Footprint Ref: CAP0201_0-5; MECHANICAL 3D STEP FILE: CAP0201_0-5; Mfr_name: MURATA; Tolerance: 10%; Distributor_name: DIGIKEY; Distributor_part_number: 490-12230-1-ND; Library Ref: CAP; Height: 0.33MM; Weight: 0.17mg; Temperature: -55°C+105°C; Datasheet: Y:\MIS_DATABASE\DATASHEETS\CAPACITORS\MURATA-GCM-SER.PDF; Crtd /date: ALVY/220219; Chkd/date: MANIRAJA/220219; PCB Footprint: CAP0201_0-5
C162 = CAP_Dup1: CAP CERAMIC 0.22uF 6.3V 10% X6S AUTO 0201; Part Reference: C162; Manufacturer: MURATA; Mistral Part No: 120019020011-R; Mfr_part_number: GRT033C80J224KE01D; Part_type: CAPACITORS\CERAMIC; Project: TI_J7ES_EVM_SOM; Wattage: NA; Customs_HS_Code: 85322990; Custom_Duty: 15%; Value: 0.22uF; Footprint Path: Y:\MIS_DATABASE\Library\ALTIUM_TOOL\PCB_FOOTPRINTS\Altium_Footprint_Lib.PcbLib; Library Path: Y:\MIS_DATABASE\Library\ALTIUM_TOOL\SCHEMATICS_PARTS\MS_DISCRETE_Library.schlib; Footprint Ref: CAP0201_0-5; MECHANICAL 3D STEP FILE: CAP0201_0-5; Mfr_name: MURATA; Tolerance: 10%; Distributor_name: DIGIKEY; Distributor_part_number: 490-12230-1-ND; Library Ref: CAP; Height: 0.33MM; Weight: 0.17mg; Temperature: -55°C+105°C; Datasheet: Y:\MIS_DATABASE\DATASHEETS\CAPACITORS\MURATA-GCM-SER.PDF; Crtd /date: ALVY/220219; Chkd/date: MANIRAJA/220219; PCB Footprint: CAP0201_0-5
C163 = CAP_Dup1: CAP CERAMIC 0.22uF 6.3V 10% X6S AUTO 0201; Part Reference: C163; Part_type: CAPACITORS\CERAMIC; Mfr_part_number: GRT033C80J224KE01D; Mfr_name: MURATA; Mistral Part No: 120019020011-R; Custom_Duty: 15%; Customs_HS_Code: 85322990; Wattage: NA; Project: TI_J7ES_EVM_SOM; Value: 0.22uF; Chkd/date: MANIRAJA/220219; Crtd /date: ALVY/220219; Datasheet: Y:\MIS_DATABASE\DATASHEETS\CAPACITORS\MURATA-GCM-SER.PDF; Temperature: -55°C+105°C; Weight: 0.17mg; Height: 0.33MM; Library Ref: CAP; Distributor_part_number: 490-12230-1-ND; Distributor_name: DIGIKEY; Tolerance: 10%; MECHANICAL 3D STEP FILE: CAP0201_0-5; Footprint Ref: CAP0201_0-5; Library Path: Y:\MIS_DATABASE\Library\ALTIUM_TOOL\SCHEMATICS_PARTS\MS_DISCRETE_Library.schlib; Footprint Path: Y:\MIS_DATABASE\Library\ALTIUM_TOOL\PCB_FOOTPRINTS\Altium_Footprint_Lib.PcbLib; Manufacturer: MURATA; PCB Footprint: CAP0201_0-5
C164 = CAP_Dup1: CAP CERAMIC 0.22uF 6.3V 10% X6S AUTO 0201; Part Reference: C164; Mistral Part No: 120019020011-R; Mfr_name: MURATA; Mfr_part_number: GRT033C80J224KE01D; Part_type: CAPACITORS\CERAMIC; Project: TI_J7ES_EVM_SOM; Wattage: NA; Customs_HS_Code: 85322990; Custom_Duty: 15%; Value: 0.22uF; Footprint Path: Y:\MIS_DATABASE\Library\ALTIUM_TOOL\PCB_FOOTPRINTS\Altium_Footprint_Lib.PcbLib; Library Path: Y:\MIS_DATABASE\Library\ALTIUM_TOOL\SCHEMATICS_PARTS\MS_DISCRETE_Library.schlib; Footprint Ref: CAP0201_0-5; MECHANICAL 3D STEP FILE: CAP0201_0-5; Tolerance: 10%; Distributor_name: DIGIKEY; Distributor_part_number: 490-12230-1-ND; Library Ref: CAP; Height: 0.33MM; Weight: 0.17mg; Temperature: -55°C+105°C; Datasheet: Y:\MIS_DATABASE\DATASHEETS\CAPACITORS\MURATA-GCM-SER.PDF; Crtd /date: ALVY/220219; Chkd/date: MANIRAJA/220219; Manufacturer: MURATA; PCB Footprint: CAP0201_0-5
C231 = CAP_Dup1: CAP CERAMIC 0.22uF 6.3V 10% X6S AUTO 0201; Part Reference: C231; Mistral Part No: 120019020011-R; Mfr_name: MURATA; Mfr_part_number: GRT033C80J224KE01D; Part_type: CAPACITORS\CERAMIC; Project: TI_J7ES_EVM_SOM; Wattage: NA; Customs_HS_Code: 85322990; Custom_Duty: 15%; SIGNAL_MODEL: CAP_CAP0201_0-5_0.22UF_0.22uF; Value: 0.22uF; PCB Footprint: CAP0201_0-5; Footprint Ref: CAP0201_0-5; Tolerance: 10%; Distributor_name: DIGIKEY; Distributor_part_number: 490-12230-1-ND; Library Ref: CAP; Height: 0.33MM; Weight: 0.17mg; Temperature: -55°C+105°C; Datasheet: Y:\MIS_DATABASE\DATASHEETS\CAPACITORS\MURATA-GCM-SER.PDF; Crtd /date: ALVY/220219; Chkd/date: MANIRAJA/220219; MECHANICAL 3D STEP FILE: CAP0201_0-5; Library Path: Y:\MIS_DATABASE\Library\ALTIUM_TOOL\SCHEMATICS_PARTS\MS_DISCRETE_Library.schlib; Footprint Path: Y:\MIS_DATABASE\Library\ALTIUM_TOOL\PCB_FOOTPRINTS\Altium_Footprint_Lib.PcbLib; Manufacturer: MURATA
C232 = CAP_Dup1: CAP CERAMIC 0.22uF 6.3V 10% X6S AUTO 0201; Part Reference: C232; Part_type: CAPACITORS\CERAMIC; Mfr_part_number: GRT033C80J224KE01D; Mfr_name: MURATA; Mistral Part No: 120019020011-R; Custom_Duty: 15%; Customs_HS_Code: 85322990; Wattage: NA; Project: TI_J7ES_EVM_SOM; SIGNAL_MODEL: CAP_CAP0201_0-5_0.22UF_0.22uF; Value: 0.22uF; PCB Footprint: CAP0201_0-5; Footprint Path: Y:\MIS_DATABASE\Library\ALTIUM_TOOL\PCB_FOOTPRINTS\Altium_Footprint_Lib.PcbLib; Library Path: Y:\MIS_DATABASE\Library\ALTIUM_TOOL\SCHEMATICS_PARTS\MS_DISCRETE_Library.schlib; MECHANICAL 3D STEP FILE: CAP0201_0-5; Chkd/date: MANIRAJA/220219; Crtd /date: ALVY/220219; Datasheet: Y:\MIS_DATABASE\DATASHEETS\CAPACITORS\MURATA-GCM-SER.PDF; Temperature: -55°C+105°C; Weight: 0.17mg; Height: 0.33MM; Library Ref: CAP; Distributor_part_number: 490-12230-1-ND; Distributor_name: DIGIKEY; Tolerance: 10%; Footprint Ref: CAP0201_0-5; Manufacturer: MURATA
R115 = RESISTOR: RES 0E 1/20W 5% 0201; Part Reference: R115; Manufacturer: YAGEO AMERICA; Mistral Part No: 110010070067-R; Mfr_part_number: RC0201JR-070RL; Part_type: RESISTORS\FIXED; Project: PB_BUGBASE; Voltage: NA; Customs_HS_Code: 85332119; Custom_Duty: 15%; Value: 0E; Footprint Ref: RES0201_0-5; Mfr_name: YAGEO AMERICA; Tolerance: 5%; Wattage: 1/20W; Package: 0201; Distributor_name: DIGIKEY; Distributor_part_number: 311-0.0NCT-ND; Library Ref: RESISTOR; Height: 0.26MM; Weight: 0.17mg; Temperature: -55°C+125°C; Datasheet: Y:\MIS_DATABASE\DATASHEETS\RESISTORS\RCXXXXL-SER_MAR18.PDF; Crtd /date: MUDDU/120710; Chkd/date: NAVEED/301214; MECHANICAL 3D STEP FILE: RES0201_0-5; Library Path: Y:\MIS_DATABASE\Library\ALTIUM_TOOL\SCHEMATICS_PARTS\MS_DISCRETE_Library.schlib; Footprint Path: Y:\MIS_DATABASE\Library\ALTIUM_TOOL\PCB_FOOTPRINTS\Altium_Footprint_Lib.PcbLib; PCB Footprint: RES0201_0-5
R116 = RESISTOR: RES 0E 1/20W 5% 0201; Part Reference: R116; Manufacturer: YAGEO AMERICA; Part_type: RESISTORS\FIXED; Mfr_part_number: RC0201JR-070RL; Mistral Part No: 110010070067-R; Custom_Duty: 15%; Customs_HS_Code: 85332119; Voltage: NA; Project: PB_BUGBASE; Value: 0E; Footprint Path: Y:\MIS_DATABASE\Library\ALTIUM_TOOL\PCB_FOOTPRINTS\Altium_Footprint_Lib.PcbLib; Library Path: Y:\MIS_DATABASE\Library\ALTIUM_TOOL\SCHEMATICS_PARTS\MS_DISCRETE_Library.schlib; MECHANICAL 3D STEP FILE: RES0201_0-5; Chkd/date: NAVEED/301214; Crtd /date: MUDDU/120710; Datasheet: Y:\MIS_DATABASE\DATASHEETS\RESISTORS\RCXXXXL-SER_MAR18.PDF; Temperature: -55°C+125°C; Weight: 0.17mg; Height: 0.26MM; Library Ref: RESISTOR; Distributor_part_number: 311-0.0NCT-ND; Distributor_name: DIGIKEY; Package: 0201; Wattage: 1/20W; Tolerance: 5%; Mfr_name: YAGEO AMERICA; Footprint Ref: RES0201_0-5; PCB Footprint: RES0201_0-5
R374 = RESISTOR_Dup2: RES 3.01K 1/20W 1% 0201; Part Reference: R374; Manufacturer: PANASONIC-ECG; Part_type: RESISTORS\FIXED; Mfr_part_number: ERJ-1GNF3011C; Mistral Part No: 110015080044-R; Custom_Duty: 15%; Customs_HS_Code: 85332119; Voltage: NA; Project: J7ES_SOM_DUAL-LEO_PMIC; Value: 3.01K_1%; PCB Footprint: RES0201_0-5; Chkd/date: MANIRAJA/160519; Crtd /date: ALVY/160519; Datasheet: Y:\MIS_DATABASE\DATASHEETS\RESISTORS\PAN-ERJSER_NOV17.PDF; Temperature: -55°C+125°C; Weight: 0.15mg; Height: 0.26MM; Library Ref: RESISTOR; Distributor_part_number: P122916CT-ND; Distributor_name: DIGIKEY; Package: 0201; Wattage: 1/20W; Tolerance: 1%; Mfr_name: PANASONIC-ECG; Footprint Ref: RES0201_0-5; MECHANICAL 3D STEP FILE: RES0201_0-5; Library Path: Y:\MIS_DATABASE\Library\ALTIUM_TOOL\SCHEMATICS_PARTS\MS_DISCRETE_Library.schlib; Footprint Path: Y:\MIS_DATABASE\Library\ALTIUM_TOOL\PCB_FOOTPRINTS\Altium_Footprint_Lib.PcbLib
TP106 = TESTPOINT_Dup1: TESTPOINT CIR 40 SMD; Part Reference: TP106; Mfr_name: LOCAL; Mistral Part No: 130009030933; MECHANICAL 3D STEP FILE: NA; Project: RAINIER-3; Value: TP40_SMD; PCB Footprint: TP40_SMD; Footprint Ref: TP40_SMD; Library Ref: TESTPOINT; Footprint Path: Y:\MIS_DATABASE\Library\ALTIUM_TOOL\PCB_FOOTPRINTS\Altium_Footprint_Lib.PcbLib; Library Path: Y:\MIS_DATABASE\Library\ALTIUM_TOOL\SCHEMATICS_PARTS\MS_DISCRETE_Library.schlib; Chkd/date: MAZHAR/190505; Crtd /date: MAZHAR/190505; Datasheet: NA; Temperature: NA; Weight: NA; Height: NA; Distributor_part_number: NA; Distributor_name: NA; Package: SMD; Wattage: NA; Voltage: NA; Tolerance: NA; Part_type: TESTPOINT; Mfr_part_number: TP40_SMD; RoHS: NA; Manufacturer: LOCAL
TP107 = TESTPOINT_Dup1: TESTPOINT CIR 40 SMD; Part Reference: TP107; Mfr_name: LOCAL; Mistral Part No: 130009030933; MECHANICAL 3D STEP FILE: NA; Project: RAINIER-3; Value: TP40_SMD; PCB Footprint: TP40_SMD; Footprint Ref: TP40_SMD; Library Ref: TESTPOINT; Footprint Path: Y:\MIS_DATABASE\Library\ALTIUM_TOOL\PCB_FOOTPRINTS\Altium_Footprint_Lib.PcbLib; Library Path: Y:\MIS_DATABASE\Library\ALTIUM_TOOL\SCHEMATICS_PARTS\MS_DISCRETE_Library.schlib; Chkd/date: MAZHAR/190505; Crtd /date: MAZHAR/190505; Datasheet: NA; Temperature: NA; Weight: NA; Height: NA; Distributor_part_number: NA; Distributor_name: NA; Package: SMD; Wattage: NA; Voltage: NA; Tolerance: NA; Part_type: TESTPOINT; Mfr_part_number: TP40_SMD; RoHS: NA; Manufacturer: LOCAL
TP108 = TESTPOINT_Dup1: TESTPOINT CIR 40 SMD; Part Reference: TP108; Mfr_name: LOCAL; Mistral Part No: 130009030933; MECHANICAL 3D STEP FILE: NA; Project: RAINIER-3; Value: TP40_SMD; PCB Footprint: TP40_SMD; Footprint Ref: TP40_SMD; Library Ref: TESTPOINT; Footprint Path: Y:\MIS_DATABASE\Library\ALTIUM_TOOL\PCB_FOOTPRINTS\Altium_Footprint_Lib.PcbLib; Library Path: Y:\MIS_DATABASE\Library\ALTIUM_TOOL\SCHEMATICS_PARTS\MS_DISCRETE_Library.schlib; Chkd/date: MAZHAR/190505; Crtd /date: MAZHAR/190505; Datasheet: NA; Temperature: NA; Weight: NA; Height: NA; Distributor_part_number: NA; Distributor_name: NA; Package: SMD; Wattage: NA; Voltage: NA; Tolerance: NA; Part_type: TESTPOINT; Mfr_part_number: TP40_SMD; RoHS: NA; Manufacturer: LOCAL
TP109 = TESTPOINT_Dup1: TESTPOINT CIR 40 SMD; Part Reference: TP109; Mfr_name: LOCAL; Mistral Part No: 130009030933; MECHANICAL 3D STEP FILE: NA; Project: RAINIER-3; Value: TP40_SMD; PCB Footprint: TP40_SMD; Footprint Ref: TP40_SMD; Library Ref: TESTPOINT; Footprint Path: Y:\MIS_DATABASE\Library\ALTIUM_TOOL\PCB_FOOTPRINTS\Altium_Footprint_Lib.PcbLib; Library Path: Y:\MIS_DATABASE\Library\ALTIUM_TOOL\SCHEMATICS_PARTS\MS_DISCRETE_Library.schlib; Chkd/date: MAZHAR/190505; Crtd /date: MAZHAR/190505; Datasheet: NA; Temperature: NA; Weight: NA; Height: NA; Distributor_part_number: NA; Distributor_name: NA; Package: SMD; Wattage: NA; Voltage: NA; Tolerance: NA; Part_type: TESTPOINT; Mfr_part_number: TP40_SMD; RoHS: NA; Manufacturer: LOCAL
U28 = J7AHPSoC-EVM_BGA1414: IC AM69 SoC EVM MICROPROCESSOR BGA1414; Part Reference: U28; Part_type: ICS\DIGITAL\MICROPROCESSOR; Mfr_name: TEXAS INSTRUMENTS; Mistral Part No: 141230020002; SPLIT_INST: TRUE; SWAP_INFO: (S1+S2+S3+S4+S5+S6+S7+S8+S9+S10+S11+S12+S13+S14+S15+S16+S17+S18+S19+S20+S21+S22+S23+S24+S25+S26); Custom_Duty: 15%; Customs_HS_Code: 85423100; Wattage: NA; Project: TI_J7AHP SK_BRD; Value: XJ784S45AALY; PCB Footprint: BGA1414_31-49_1230X1230_2-7; Footprint Path: Y:\MIS_DATABASE\Library\ALTIUM_TOOL\PCB_FOOTPRINTS\Altium_Footprint_Lib.PcbLib; Library Path: Y:\MIS_DATABASE\Library\ALTIUM_TOOL\SCHEMATICS_PARTS\MS_MICROPROCESSOR_Library.schlib; MECHANICAL 3D STEP FILE: BGA1414_31-49_1230X1230_2-7; RoHS: NA; Chkd/date: MANIRAJA/151221; Crtd /date: ALVY/141221; Datasheet: Y:\MIS_DATABASE\DATASHEETS\ICS\DIGITAL\MICROCONTROLLER\J7AHP-SoC-EVM.PDF; Temperature: NA; Weight: NA; Height: 2.70MM; Library Ref: J7AHPSoC-EVM_BGA1414; Distributor_part_number: NA; Distributor_name: NA; Package: BGA1414; Voltage: NA; Tolerance: NA; Mfr_part_number: XJ784S45AALY; Footprint Ref: BGA1414_31-49_1230X1230_2-7; Manufacturer: TEXAS INSTRUMENTS